# EasyEDA Pro project camara-detection.eprj, board XiaoZhi
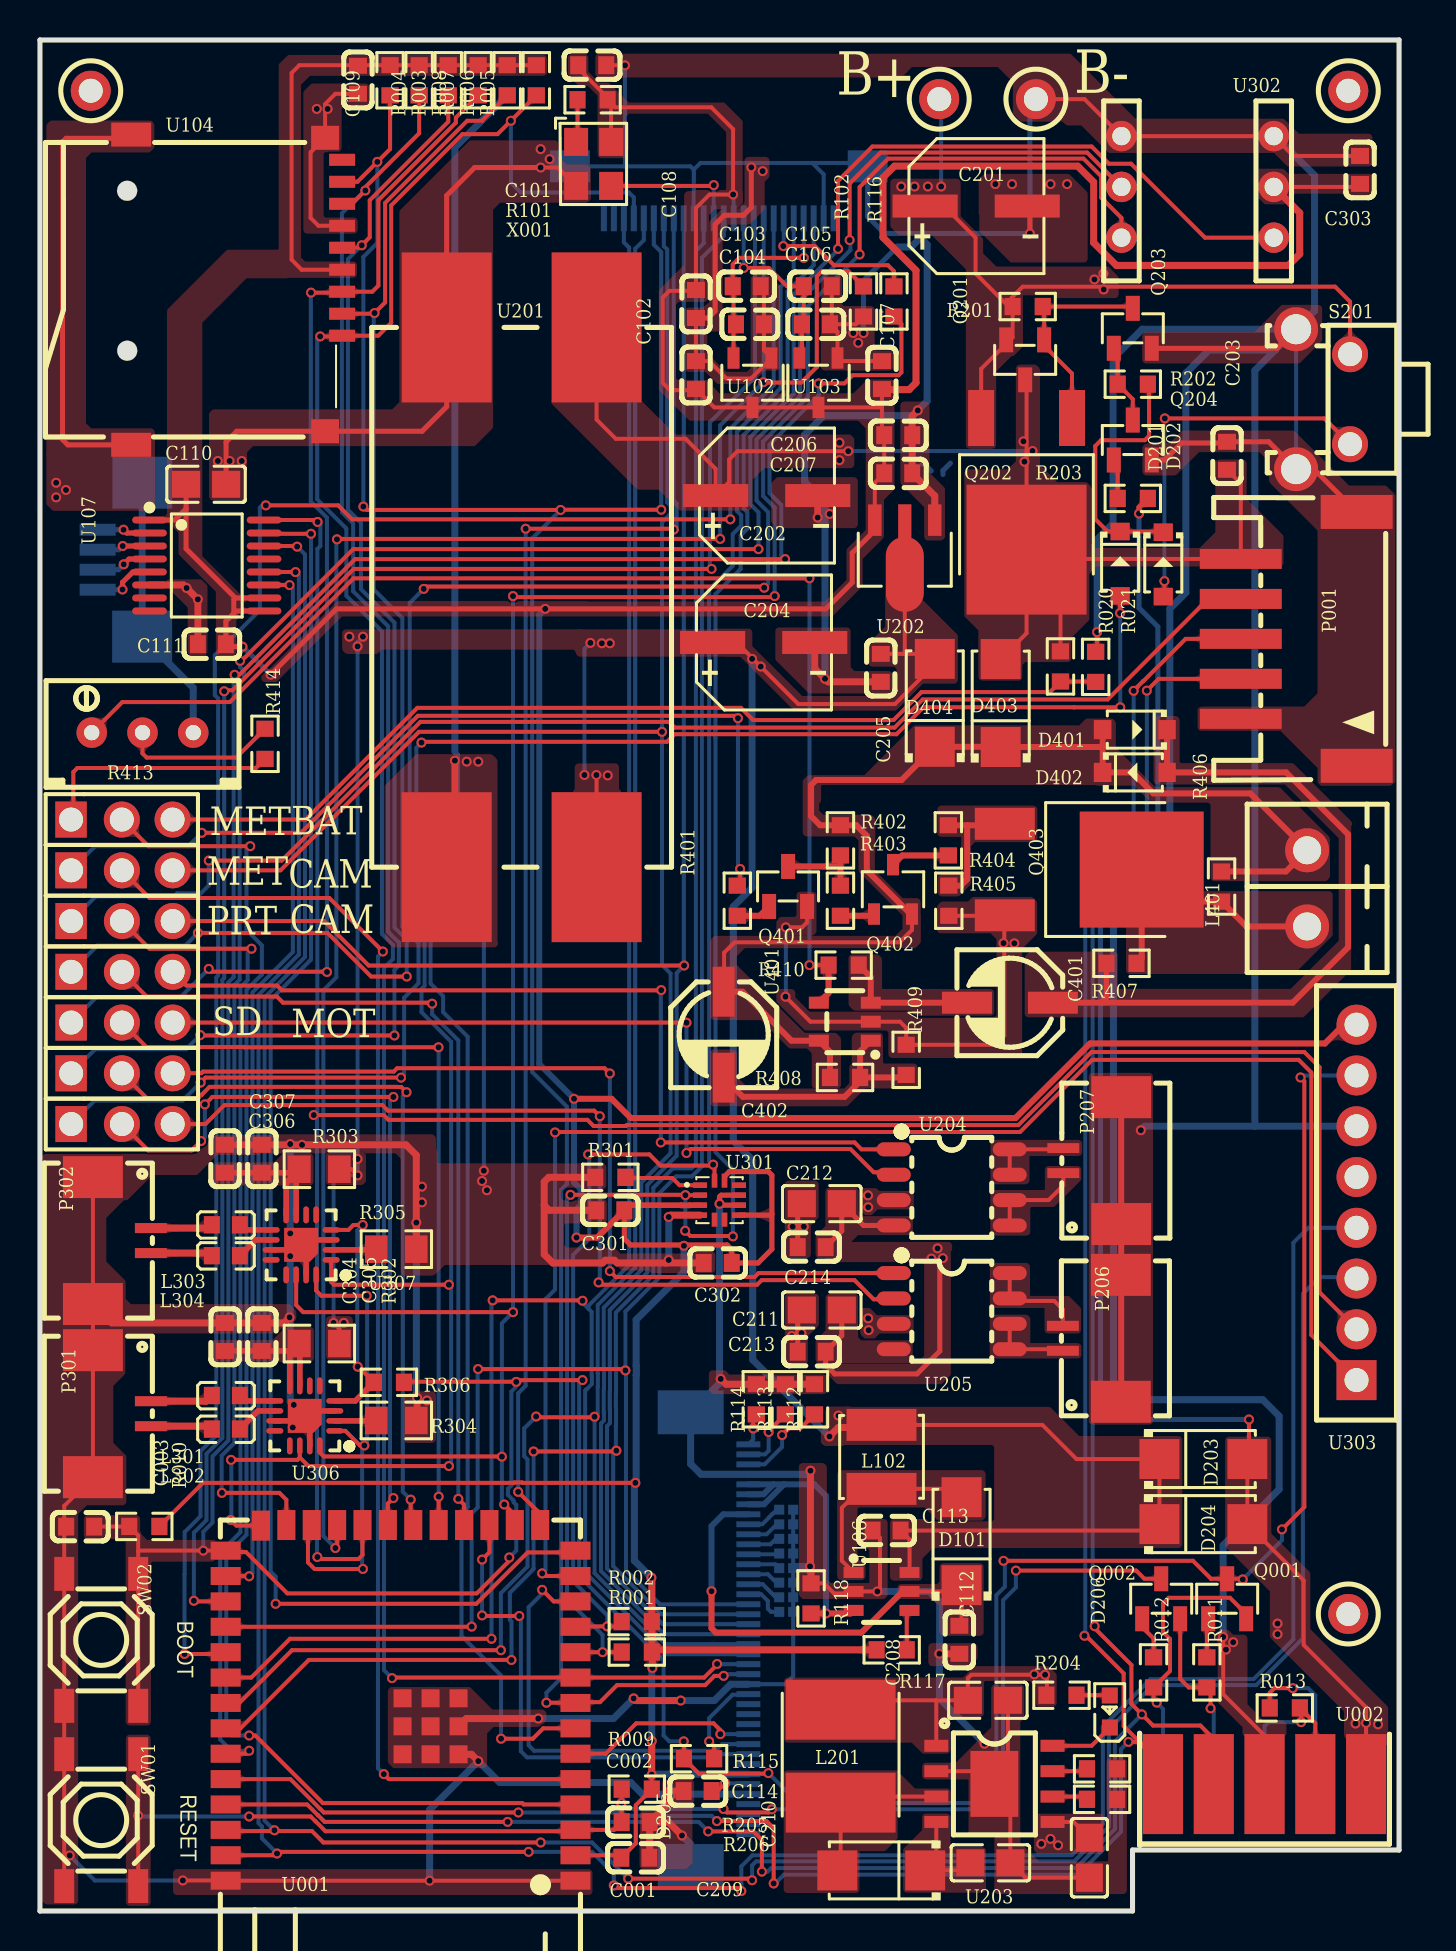
[diagram p3: board, top side]
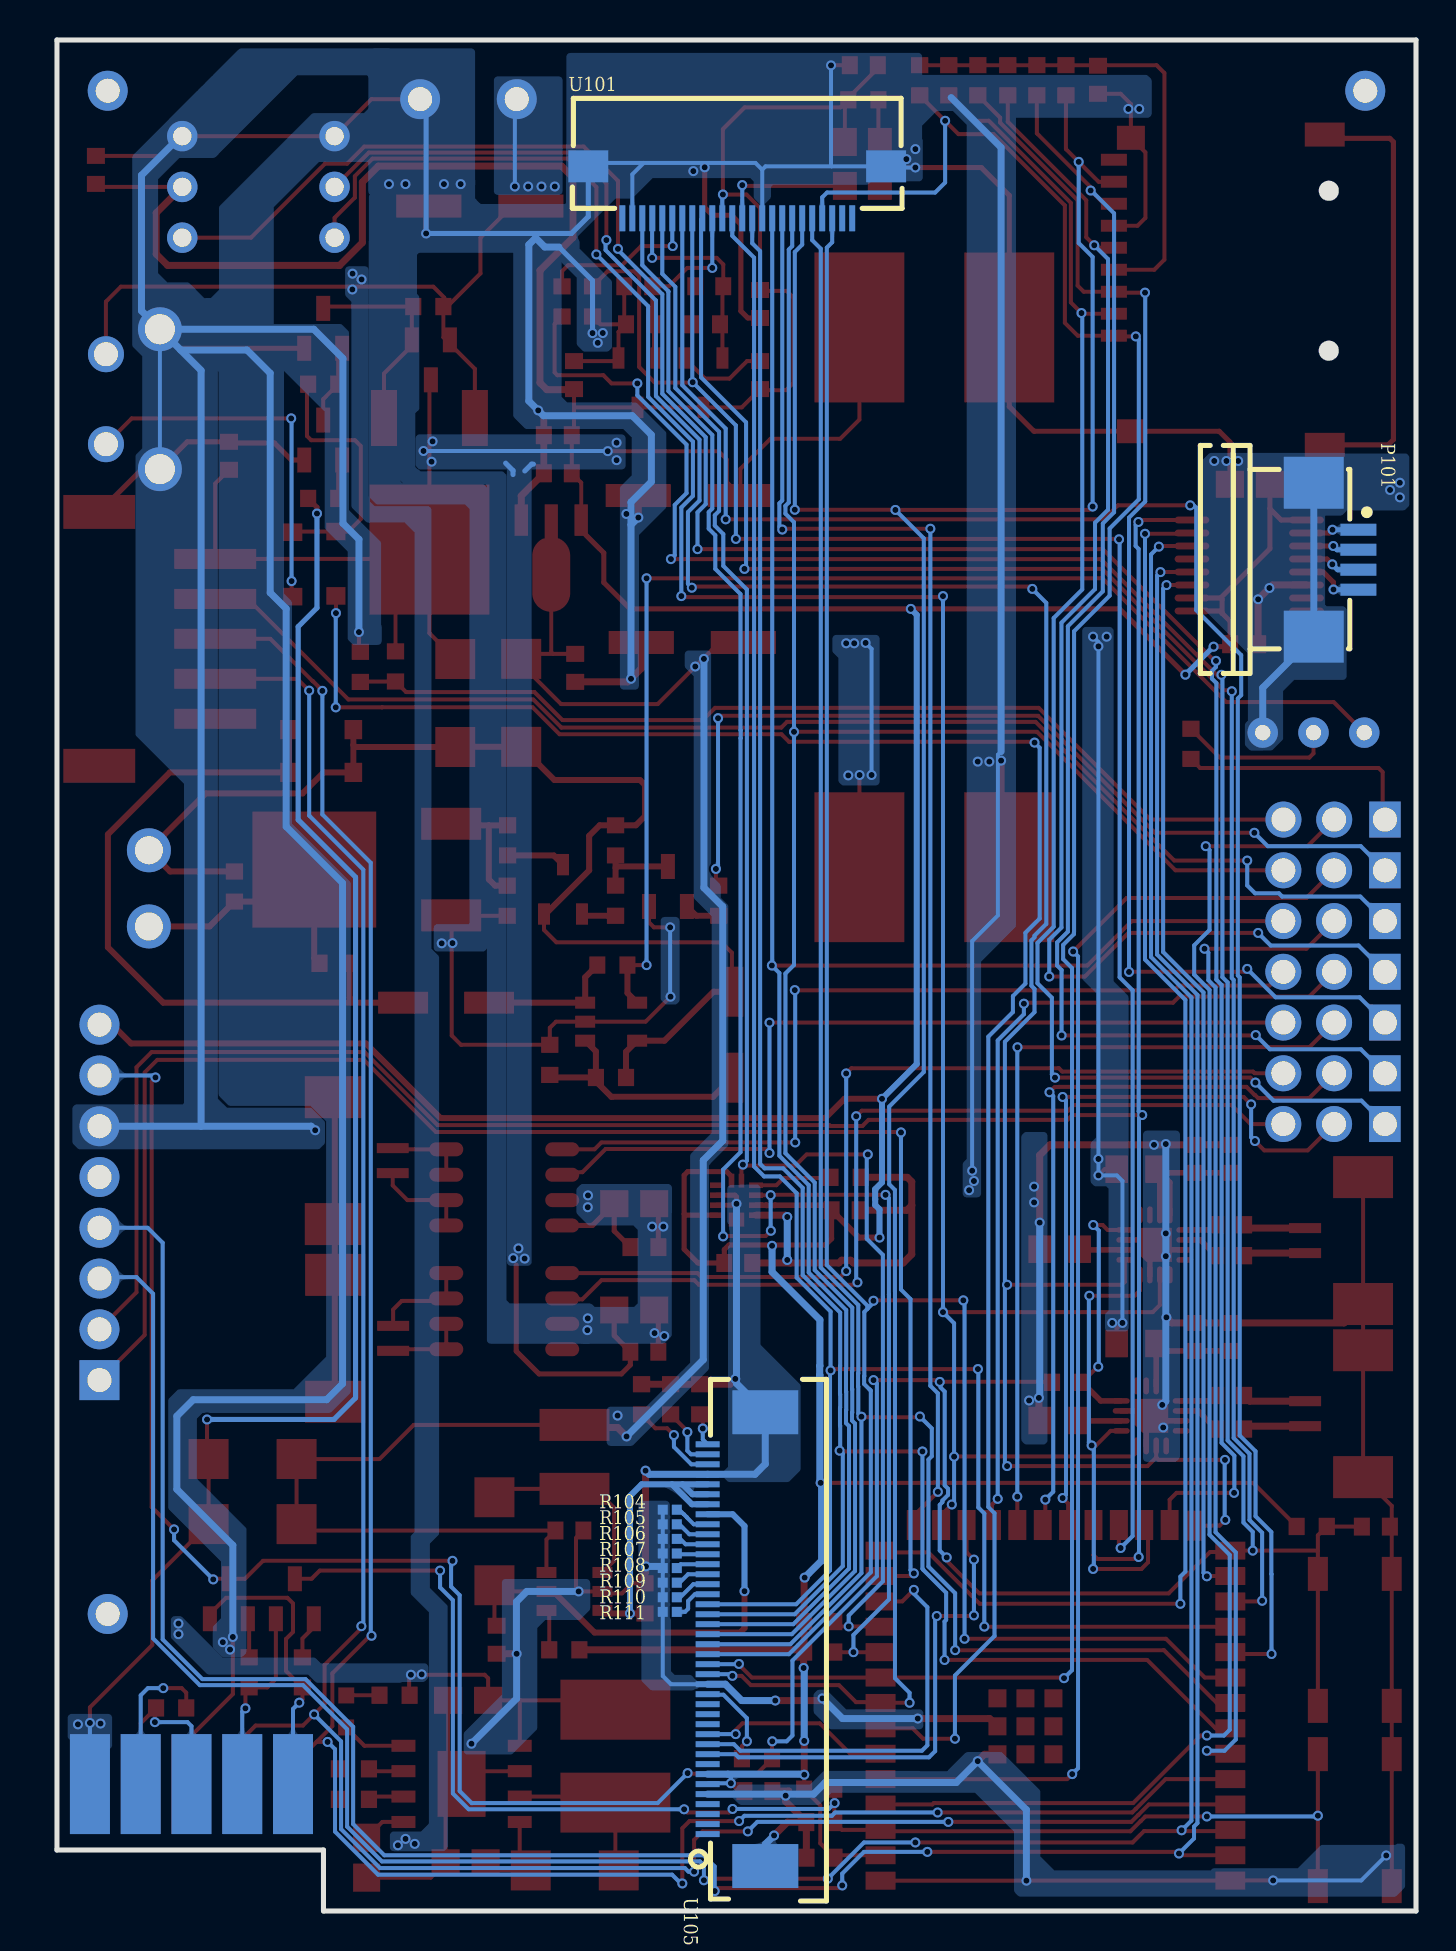
[diagram p4: board, bottom side, seen from below]

Outline 68 x 93.6 mm; copper layers: Top Layer, Bottom Layer. Coordinates in mm from the lower left corner of the outline.
Outline path: 0,93.6 68,93.6 68,3.05 54.67,3.05 54.67,0 0,0 0,93.6
Stack: SUBSTRATE1 0.32mm FR-4 er 4.8 / Bottom Layer 0.035mm

## Design rules (mm)
spacing copperThickness1oz (default): track to track 0.254, other pairs 0.254 to 0.3
spacing copperThickness2oz: track to track 0.254, other pairs 0.254 to 0.3
track width copperThickness1oz (default): min 0.127, default 0.127, max 2.54
track width copperThickness2oz: min 0.203, default 0.203, max 2.54
differential pair differentialPair (default): width min 0.127, default 0.127, max 2.54; gap min 0.152, default 0.152
via viaSize (default): diameter min 0.5, default 0.5, max 10; hole min 0.3, default 0.3, max 6.3

## Placement (name value [footprint] x y rotation side)
C001  CAP_0603  [C0603]  29.79 2.67 180 top
C002  CAP_0603  [C0603]  29.81 4.44 0 top
C003  CAP_0603  [C0603]  2.01 19.23 180 top
C101  CAP_0603  [C0603]  27.63 92.34 0 top
C102  CAP_0603  [C0603]  32.82 76.83 270 top
C103  CAP_0603  [C0603]  35.36 81.28 0 top
C104  CAP_0603  [C0603]  35.52 79.37 0 top
C105  CAP_0603  [C0603]  38.92 81.28 0 top
C106  CAP_0603  [C0603]  38.83 79.37 0 top
C107  100nF  [C0603]  42.13 76.83 90 top
C108  0.1UF  [C0603]  32.82 80.39 270 top
C109  CAP_0603  [C0603]  15.91 91.61 90 top
C110  CGA0805X5R106K250MT  [C0805]  8.31 71.37 0 top
C111  CGA0603X7R104K500JT  [C0603]  8.6 63.37 0 top
C112  1uF  [C0603]  46 13.57 90 top
C113  1uF  [C0603]  42.36 19.03 0 top
C114  CAP_0603  [C0603]  32.9 6 180 top
C201  VEJ101M1CTR-0605  [CAP-SMD_BD6.3-L6.6-W6.6-LS7.2-R-RD]  46.84 85.29 180 top
C202  VEJ101M1CTR-0605  [CAP-SMD_BD6.3-L6.6-W6.6-LS7.2-R-RD]  36.36 70.81 180 top
C203  CAP_0603  [C0603]  59.39 72.8 270 top
C204  VEJ101M1CTR-0605  [CAP-SMD_BD6.3-L6.6-W6.6-LS7.2-R-RD]  36.21 63.46 180 top
C205  CAP_0603  [C0603]  42.07 62.19 90 top
C206  CAP_0603  [C0603]  42.94 73.83 180 top
C207  CAP_0603  [C0603]  42.94 71.92 180 top
C208  CAP_0603  [C0805]  47.43 10.54 0 top
C209  CAP_0603  [C0805]  47.55 2.41 0 top
C210  CAP_0603  [C0805]  52.51 2.67 270 top
C211  CAP_0603  [C0805]  39.12 30.07 180 top
C212  CAP_0603  [C0805]  39.12 35.39 180 top
C213  CAP_0603  [C0603]  38.61 27.98 0 top
C214  CAP_0603  [C0603]  38.61 33.21 0 top
C301  CGA0603X7R104K500JT  [C0603]  28.54 35.05 180 top
C302  CGA0603X7R104K500JT  [C0603]  33.91 32.42 0 top
C303  CGA0603X7R104K500JT  [C0603]  66.05 87.1 270 top
C304  22uF  [C0603]  9.26 28.72 270 top
C305  100nF  [C0603]  11.1 28.72 270 top
C306  22uF  [C0603]  11.1 37.63 270 top
C307  100nF  [C0603]  9.26 37.63 270 top
C401  1uF/50V  [CAP-SMD_BD5.0-L5.3-W5.3-RD]  48.53 45.44 0 top
C402  100uF/50V  [CAP-SMD_BD5.0-L5.3-W5.3-RD]  34.21 43.84 90 top
D101  SS14_C84343  [SMA_L4.3-W2.6-LS5.2-RD]  46.11 18.5 90 top
D201  1N4148W-E3-18  [SOD-123_L2.7-W1.6-LS3.7-FD]  56.2 67.36 90 top
D202  1N4148W-E3-18  [SOD-123_L2.7-W1.6-LS3.7-FD]  54.04 67.4 90 top
D203  SS34A_C211775  [SMA_L4.3-W2.6-LS5.2-RD]  58.21 22.61 0 top
D204  SS34A_C211775  [SMA_L4.3-W2.6-LS5.2-RD]  58.21 19.35 0 top
D205  SS34A_C211775  [SMA_L4.3-W2.6-LS5.2-RD]  42.09 2.03 180 top
D206  LED_0603-R  [LED_0603]  53.52 10.03 90 top
D401  1N4148W-E3-18  [SOD-123_L2.7-W1.6-LS3.7-FD]  54.78 59.1 0 top
D402  1N4148W-E3-18  [SOD-123_L2.7-W1.6-LS3.7-FD]  54.78 56.96 180 top
D403  SS34A_C211775  [SMA_L4.3-W2.6-LS5.2-RD]  48.07 60.43 90 top
D404  SS34A_C211775  [SMA_L4.3-W2.6-LS5.2-RD]  44.77 60.44 90 top
H001  2.54-1*3P针  [HDR-TH_3P-P2.54-V-M-1]  4.09 54.6 0 top
H002  2.54-1*3P针  [HDR-TH_3P-P2.54-V-M-1]  4.1 52.06 0 top
H003  2.54-1*3P针  [HDR-TH_3P-P2.54-V-M-1]  4.1 49.52 0 top
H004  2.54-1*3P针  [HDR-TH_3P-P2.54-V-M-1]  4.1 46.98 0 top
H005  2.54-1*3P针  [HDR-TH_3P-P2.54-V-M-1]  4.1 44.45 0 top
H006  2.54-1*3P针  [HDR-TH_3P-P2.54-V-M-1]  4.1 41.91 0 top
H007  2.54-1*3P针  [HDR-TH_3P-P2.54-V-M-1]  4.1 39.37 0 top
L102  YNR4030-220M  [IND-SMD_L4.0-W4.0]  42.11 22.72 270 top
L201  2.2uH  [IND-SMD_L5.8-W5.2]  40.06 7.75 270 top
L301  1uH  [L0603]  9.3 25.79 180 top
L302  1uH  [L0603]  9.3 24.11 180 top
L303  1uH  [L0603]  9.3 34.33 180 top
L304  1uH  [L0603]  9.3 32.78 180 top
L401  300~500uH  [CONN-TH_2P-P3.81_KF2EDGV-3.81-2P]  63.4 51.16 90 top
P001  HX20007-5AWB  [CONN-SMD_5P-P2.00_HX20007-5AWB]  62.98 63.64 90 top
P101  TS  [FPC-SMD_4P-P1.00_AFA07-S04ECA-00]  4 67.6 270 bottom
P201  -  [Single_Pin]  65.46 14.86 0 top
P202  -  [Single_Pin]  49.83 90.64 0 top
P203  -  [Single_Pin]  2.54 91.06 0 top
P204  -  [Single_Pin]  65.46 91.06 0 top
P205  -  [Single_Pin]  44.99 90.64 0 top
P206  1.25-2P WT  [CONN-SMD_1.25-2PWT]  52.63 28.65 270 top
P207  1.25-2P WT  [CONN-SMD_1.25-2PWT]  52.65 37.54 270 top
P301  1.25-2P WT  [CONN-SMD_1.25-2PWT]  4.1 24.88 90 top
P302  1.25-2P WT  [CONN-SMD_1.25-2PWT]  4.1 33.54 90 top
Q001  SS8050  [SOT-23-3_L2.9-W1.3-P1.90-LS2.4-BR]  59.4 15.62 270 top
Q002  SS8050  [SOT-23-3_L2.9-W1.3-P1.90-LS2.4-BR]  56.1 15.62 270 top
Q201  AO3401_C181091  [SOT-23-3_L2.9-W1.3-P1.90-LS2.4-BR]  49.29 77.6 90 top
Q202  NCE40P40K  [TO-252-2_L6.6-W6.1-P4.57-LS9.9-TL-CW]  49.36 71.4 270 top
Q203  SS8050  [SOT-23-3_L2.9-W1.3-P1.90-LS2.4-BR]  54.68 79.17 270 top
Q204  SS8050  [SOT-23-3_L2.9-W1.3-P1.90-LS2.4-BR]  54.68 73.59 270 top
Q401  MMBT3904  [SOT-23-3_L2.9-W1.3-P1.90-LS2.4-BR]  37.43 51.25 270 top
Q402  MMBT3906-7-F  [SOT-23-3_L2.9-W1.6-P1.90-LS2.8-BR]  42.68 51.11 270 top
Q403  WSF10N40  [TO-252-2_L6.6-W6.1-P4.57-LS9.9-BR-CW]  51.7 52.1 180 top
R001  3.3K  [R0603]  29.86 12.95 180 top
R002  3.3K  [R0603]  29.86 14.48 180 top
R003  3.3K  [R0603]  18.97 91.58 270 top
R004  3.3K  [R0603]  17.52 91.58 270 top
R005  3.3K  [R0603]  24.83 91.58 270 top
R006  3.3K  [R0603]  23.38 91.58 270 top
R007  3.3K  [R0603]  21.92 91.58 270 top
R008  3.3K  [R0603]  20.43 91.58 270 top
R009  10K  [R0603]  29.86 6.1 0 top
R010  10K  [R0603]  5.22 19.24 0 top
R011  10K  [R0603]  58.38 11.94 270 top
R012  10K  [R0603]  55.72 11.94 270 top
R013  10  [R0603]  62.29 10.16 180 top
R020  100K  [R0603]  51.06 62.26 270 top
R021  10K  [R0603]  52.82 62.24 90 top
R101  4.7K  [R0603]  27.65 90.61 0 top
R102  4.7K  [R0603]  41.2 80.52 270 top
R104  0R  [short_package]  37.34 20.07 270 bottom
R105  0R  [short_package]  37.34 19.34 270 bottom
R106  0R  [short_package]  37.34 18.62 270 bottom
R107  0R  [short_package]  37.34 17.89 270 bottom
R108  0R  [short_package]  37.34 17.16 270 bottom
R109  0R  [short_package]  37.34 16.43 270 bottom
R110  0R  [short_package]  37.34 15.7 270 bottom
R111  0R  [short_package]  37.34 14.97 270 bottom
R112  0R  [R0603]  38.75 25.6 270 top
R113  0R  [R0603]  37.3 25.6 270 top
R114  0R  [R0603]  35.84 25.6 270 top
R115  0R  [R0603]  32.98 7.62 0 top
R116  0R  [R0603]  42.73 80.52 90 top
R117  1k  [R0603]  42.61 13.07 180 top
R118  5.1R  [R0603]  38.58 15.64 270 top
R201  Res_0603  [R0603]  49.42 80.26 180 top
R202  Res_0603  [R0603]  54.68 76.38 0 top
R203  Res_0603  [R0603]  54.68 70.67 0 top
R204  Res_0603  [R0603]  51.11 10.79 180 top
R205  Res_0603  [R0603]  53.14 7.11 180 top
R206  Res_0603  [R0603]  53.14 5.59 180 top
R301  2R2  [R0603]  28.54 36.7 0 top
R302  0805W8F1002T5E_C17414  [R0805]  13.98 28.39 180 top
R303  0805W8F1002T5E_C17414  [R0805]  13.98 37.11 180 top
R304  NC  [R0805]  17.83 24.54 180 top
R305  NC  [R0805]  17.83 33.11 180 top
R306  CR0603FA10R0G  [R0603]  17.46 26.45 180 top
R401  1K  [R0603]  34.89 50.54 270 top
R402  6.8K  [R0603]  40.05 53.56 90 top
R403  1K  [R0603]  40.05 50.54 270 top
R404  100  [R0603]  45.45 53.56 270 top
R405  150  [R0603]  45.47 50.54 90 top
R406  390  [R0603]  59.12 51.25 90 top
R407  390  [R0603]  54.11 47.41 0 top
R408  47K  [R0603]  40.28 41.7 0 top
R409  62K  [R0603]  43.34 42.58 90 top
R410  2M  [R0603]  40.21 47.32 0 top
R413  3296W-1-102_C330429  [RES-ADJ-TH_3296W]  5.13 58.95 90 top
R414  10  [R0603]  11.26 58.39 270 top
S201  TC-1102N-C-A-B  [SW-TH_TC-1102N-C-A-B]  64.2 75.63 90 top
SW01  TS-1187A-B-A-B  [SW-SMD_4P-L5.1-W5.1-P3.70-LS6.5-TL-2]  3.06 4.55 270 top
SW02  TS-1187A-B-A-B  [SW-SMD_4P-L5.1-W5.1-P3.70-LS6.5-TL-2]  3.06 13.56 270 top
U001  -  [ESP32-S3-WROOM-1U]  17.92 10.41 180 top
U002  CH343_Module  [CH343_Module_Mini]  61.4 6.35 180 top
U101  ov2640  [FPC-SMD_P0.50-24P_FGS-XJ-H2.0]  33.96 85.98 180 bottom
U102  XC6206-2.8V  [SOT-23-3_L2.9-W1.6-P1.90-LS2.8-BR]  35.65 76.45 90 top
U103  XC6206-2.8V  [SOT-23-3_L2.9-W1.6-P1.90-LS2.8-BR]  38.95 76.45 90 top
U104  TF-01A_C91145  [TF-SMD_TF-01A]  9.84 81.11 270 top
U105  NV3041_480X272  [FPC-SMD_AFC07-S40FCA-00]  34 13.6 90 bottom
U106  MT9201  [SOT-23-6_L2.9-W1.6-P0.95-LS2.8-BR]  42.11 15.99 180 top
U107  TSC2046IPWR  [TSSOP-16_L5.0-W4.4-P0.65-LS6.4-BL]  8.35 67.31 270 top
U201  CX8823_5V  [CX8823_MO]  31.6 79.22 270 top
U202  ME6209A33PG  [SOT-89-3_L4.5-W2.5-P1.50-LS4.2-BR]  43.27 68.22 90 top
U203  CS5095E  [ESOP-8_L4.9-W3.9-P1.27-LS6.0-BL-EP]  47.75 6.36 270 top
U204  AM2837  [sop-8_l5.0-w4.0-p1.27-ls6.2-bl]  45.62 36.2 270 top
U205  AM2837  [sop-8_l5.0-w4.0-p1.27-ls6.2-bl]  45.62 30.01 270 top
U301  SC7A20HTR  [LGA-12_L2.0-W2.0-P0.50-TL]  34 35.56 0 top
U302  INMP441  [INMP441_MODULE]  61.73 83.71 90 top
U303  -  [RFID_RC522]  67.87 16.56 90 top
U306  HT517  [QFN-16_L3.0-W3.0-P0.50-TL-EP1.7]  13.25 24.77 180 top
U307  HT517  [QFN-16_L3.0-W3.0-P0.50-TL-EP1.7]  13.07 33.32 180 top
U401  LM321-TR_C97688  [SOT-23-5_L3.0-W1.7-P0.95-LS2.8-BR]  40.27 44.49 0 top
X001  Q33310F70049000  [OSC-SMD_4P-L3.2-W2.5-BL]  27.7 87.4 270 top

## Footprints (pads in the part's own frame, mm; a bottom-side part is the same pattern mirrored in y, then rotated)
C0603
  rect 0.8x0.9 smd: 1(-0.7,0) 2(0.7,0)
C0805
  rect 1.41x1.35 smd: 1(-1,0) 2(1,0)
CAP-SMD_BD5.0-L5.3-W5.3-RD
  rect 2.5x1.1 smd: 1(2.15,0) 2(-2.15,0)
CAP-SMD_BD6.3-L6.6-W6.6-LS7.2-R-RD
  rect 3.26x1.15 smd: 1(2.555,0) 2(-2.555,0)
CH343_Module_Mini
  rect 2x5 smd: 1(-4.953,0) 2(-2.413,0) 3(0.127,0) 4(2.667,0) 5(5.207,0)
  rect 2x5 smd far side: 6(5.207,0) 7(2.667,0) 8(0.127,0) 9(-2.413,0) 10(-4.953,0)
CONN-SMD_1.25-2PWT
  rect 0.5x1.6 smd: 1(0.625,-1.45) 2(-0.625,-1.45)
  rect 2.1x2.999 smd: 3(3.175,1.45) 4(-3.175,1.45)
CONN-SMD_5P-P2.00_HX20007-5AWB
  rect 1.001x4.099 smd: 1(-4,2.901) 2(-1.999,2.901) 3(0,2.901) 4(1.999,2.901) 5(4,2.901)
  rect 1.7x3.599 smd: 6(6.35,-2.901) 7(-6.35,-2.901)
CONN-TH_2P-P3.81_KF2EDGV-3.81-2P
  round 2.2 hole 1.4: 1(-1.905,0) 2(1.905,0)
CX8823_MO
  rect 7.5x4.5 smd: 1(0,-3.75) 2(27,-3.75) 3(0,-11.25) 4(27,-11.25)
ESOP-8_L4.9-W3.9-P1.27-LS6.0-BL-EP
  rect 0.6x1.2 smd: 1(-1.905,-2.909) 2(-0.635,-2.909) 3(0.635,-2.909) 4(1.905,-2.909) 5(1.905,2.909) 6(0.635,2.909) 7(-0.635,2.909) 8(-1.905,2.909)
  rect 3.3x2.4 smd: 9(0,0)
ESP32-S3-WROOM-1U
  rect 1.5x0.9 smd: 1(-8.877,8.895) 2(-8.877,7.625) 3(-8.877,6.355) 4(-8.877,5.085) 5(-8.877,3.815) 6(-8.877,2.545) 7(-8.877,1.275) 8(-8.877,0.005) 9(-8.877,-1.265) 10(-8.877,-2.535) 11(-8.877,-3.805) 12(-8.877,-5.075) 13(-8.877,-6.345) 14(-8.877,-7.615) 27(8.623,-7.615) 28(8.623,-6.345) 29(8.623,-5.075) 30(8.623,-3.805) 31(8.623,-2.535) 32(8.623,-1.265) 33(8.623,0.005) 34(8.623,1.275) 35(8.623,2.545) 36(8.623,3.815) 37(8.623,5.085) 38(8.623,6.355) 39(8.623,7.625) 40(8.623,8.895)
  rect 0.9x1.5 smd: 15(-7.112,-8.895) 16(-5.842,-8.895) 17(-4.572,-8.895) 18(-3.302,-8.895) 19(-2.032,-8.895) 20(-0.762,-8.895) 21(0.508,-8.895) 22(1.778,-8.895) 23(3.048,-8.895) 24(4.318,-8.895) 25(5.588,-8.895) 26(6.858,-8.865)
  rect 0.9x0.9 smd: 41(-3.027,2.575) 41(-3.027,1.175) 41(-3.027,-0.225) 41(-1.627,2.575) 41(-1.627,1.175) 41(-1.627,-0.225) 41(-0.227,2.575) 41(-0.227,1.175) 41(-0.227,-0.225)
FPC-SMD_4P-P1.00_AFA07-S04ECA-00
  rect 0.6x1.8 smd: 1(-1.5,1.115) 2(-0.5,1.115) 3(0.5,1.115) 4(1.5,1.115)
  rect 2.6x3 smd: 5(3.85,-1.115) 6(-3.85,-1.115)
FPC-SMD_AFC07-S40FCA-00
  rect 0.299x1.199 smd: 1(-9.751,1.442) 2(-9.251,1.442) 3(-8.753,1.442) 4(-8.252,1.442) 5(-7.752,1.442) 6(-7.252,1.442) 7(-6.752,1.442) 8(-6.251,1.442) 9(-5.753,1.442) 10(-5.253,1.442) 11(-4.753,1.442) 12(-4.252,1.442) 13(-3.752,1.442) 14(-3.251,1.442) 15(-2.751,1.442) 16(-2.253,1.442) 17(-1.752,1.442) 18(-1.252,1.442) 19(-0.752,1.442) 20(-0.252,1.442) 21(0.249,1.442) 22(0.75,1.442) 23(1.247,1.442) 24(1.748,1.442) 25(2.248,1.442) 26(2.748,1.442) 27(3.248,1.442) 28(3.749,1.442) 29(4.247,1.442) 30(4.747,1.442) 31(5.247,1.442) 32(5.748,1.442) 33(6.248,1.442) 34(6.749,1.442) 35(7.249,1.442) 36(7.747,1.442) 37(8.248,1.442) 38(8.748,1.442) 39(9.248,1.442) 40(9.748,1.442)
  rect 2.2x3.3 smd: 41(-11.348,-1.442) 42(11.351,-1.442)
FPC-SMD_P0.50-24P_FGS-XJ-H2.0
  rect 0.3x1.3 smd: 1(-5.748,-1.3) 2(-5.248,-1.3) 3(-4.748,-1.3) 4(-4.248,-1.3) 5(-3.748,-1.3) 6(-3.248,-1.3) 7(-2.748,-1.3) 8(-2.248,-1.3) 9(-1.748,-1.3) 10(-1.248,-1.3) 11(-0.748,-1.3) 12(-0.248,-1.3) 13(0.252,-1.3) 14(0.752,-1.3) 15(1.252,-1.3) 16(1.752,-1.3) 17(2.252,-1.3) 18(2.752,-1.3) 19(3.252,-1.3) 20(3.752,-1.3) 21(4.252,-1.3) 22(4.752,-1.3) 23(5.252,-1.3) 24(5.752,-1.3)
  rect 2x1.6 smd: 25(7.45,1.3) 26(-7.45,1.3)
HDR-TH_3P-P2.54-V-M-1
  rect 1.575x1.801 hole 1.199: 1(-2.54,0)
  round 1.801 hole 1.199: 2(0,0) 3(2.54,0)
IND-SMD_L4.0-W4.0
  rect 1.6x3.5 smd: 1(-1.6,0) 2(1.6,0)
IND-SMD_L5.8-W5.2
  rect 3x5.5 smd: 1(2.325,0) 2(-2.325,0)
INMP441_MODULE
  round 1.524 hole 0.914: 1(0,0) 2(2.54,0) 3(5.08,0) 4(5.08,7.62) 5(2.54,7.62) 6(0,7.62)
L0603
  rect 0.8x0.864 smd: 1(-0.7,0) 2(0.7,0)
LED_0603
  rect 0.8x0.8 smd: 1(-0.851,-0.01) 2(0.75,-0.005)
LGA-12_L2.0-W2.0-P0.50-TL
  rect 0.7x0.28 smd: 1(-0.975,0.75) 2(-0.975,0.25) 3(-0.975,-0.25) 4(-0.975,-0.75) 7(0.975,-0.75) 8(0.975,-0.25) 9(0.975,0.25) 10(0.975,0.75)
  rect 0.28x0.7 smd: 5(-0.25,-0.975) 6(0.25,-0.975) 11(0.25,0.975) 12(-0.25,0.975)
OSC-SMD_4P-L3.2-W2.5-BL
  rect 1.4x1.2 smd: 1(-1.1,-0.875) 2(1.1,-0.875) 3(1.1,0.875) 4(-1.1,0.875)
QFN-16_L3.0-W3.0-P0.50-TL-EP1.7
  oval 0.851x0.28 smd: 1(-1.501,0.75) 2(-1.501,0.249) 3(-1.501,-0.249) 4(-1.501,-0.75) 9(1.501,-0.75) 10(1.501,-0.249) 11(1.501,0.249) 12(1.501,0.75)
  oval 0.28x0.851 smd: 5(-0.75,-1.501) 6(-0.249,-1.501) 7(0.249,-1.501) 8(0.75,-1.501) 13(0.75,1.501) 14(0.249,1.501) 15(-0.249,1.501) 16(-0.75,1.501)
  round 0.341 smd: 17(0,0)
R0603
  rect 0.806x0.864 smd: 1(-0.753,0) 2(0.753,0)
R0805
  rect 1.133x1.377 smd: 1(-1,0) 2(1,0)
RES-ADJ-TH_3296W
  round 1.524 hole 0.762: 1(0,2.54) 2(0,0) 3(0,-2.54)
RFID_RC522
  rect 2x2 hole 1.2: 1(10,2)
  round 2 hole 1.2: 2(12.54,2) 3(15.08,2) 4(17.62,2) 5(20.16,2) 6(22.7,2) 7(25.24,2) 8(27.78,2)
short_package
  rect 0.5x0.5 smd: 1(0,0.35) 2(0,-0.35)
Single_Pin
  round 2 hole 1.2: 1(0,0)
SMA_L4.3-W2.6-LS5.2-RD
  rect 2x2 smd: 1(-2.2,0) 2(2.2,0)
SOD-123_L2.7-W1.6-LS3.7-FD
  rect 0.879x0.96 smd: 1(-1.611,0) 2(1.611,0)
sop-8_l5.0-w4.0-p1.27-ls6.2-bl
  oval 0.701x1.7 smd: 1(-1.905,-2.901) 2(-0.635,-2.901) 3(0.635,-2.901) 4(1.905,-2.901) 5(1.905,2.901) 6(0.635,2.901) 7(-0.635,2.901) 8(-1.905,2.901)
SOT-23-3_L2.9-W1.3-P1.90-LS2.4-BR
  rect 1.25x0.7 smd: 1(1,-0.95) 2(1,0.95) 3(-1,0)
SOT-23-3_L2.9-W1.6-P1.90-LS2.8-BR
  rect 1.07x0.6 smd: 1(1.235,-0.95) 2(1.235,0.95) 3(-1.235,0)
SOT-23-5_L3.0-W1.7-P0.95-LS2.8-BR
  rect 1x0.6 smd: 1(1.3,-0.95) 2(1.3,0) 3(1.3,0.95) 4(-1.3,0.95) 5(-1.3,-0.95)
SOT-23-6_L2.9-W1.6-P0.95-LS2.8-BR
  rect 1x0.55 smd: 1(1.4,-0.95) 2(1.4,0) 3(1.4,0.95) 4(-1.4,0.95) 5(-1.4,0) 6(-1.4,-0.95)
SOT-89-3_L4.5-W2.5-P1.50-LS4.2-BR
  rect 1.575x0.672 smd: 1(1.356,-1.5) 3(1.356,1.5)
  round 0.38 smd: 2(-1.356,0)
SW-SMD_4P-L5.1-W5.1-P3.70-LS6.5-TL-2
  rect 1.7x1 smd: 1(-3.3,1.85) 2(3.3,1.85) 3(-3.3,-1.85) 4(3.3,-1.85)
SW-TH_TC-1102N-C-A-B
  round 1.801 hole 1.199: 1(-2.251,-1.349) 2(2.251,-1.349)
  round 2.2 hole 1.501: 3(-3.5,1.351) 4(3.5,1.351)
TF-SMD_TF-01A
  rect 0.6x1.3 smd: 1(2.3,5.276) 2(1.2,5.276) 3(0.101,5.276) 4(-1,5.276) 5(-2.099,5.276) 6(-3.2,5.276) 7(-4.3,5.276) 8(-5.399,5.276) 9(-6.5,5.276)
  rect 1.2x1.4 smd: 10(-7.599,4.426) 13(7.08,4.426)
  rect 1.2x2 smd: 11(-7.76,-5.276) 12(7.76,-5.276)
TO-252-2_L6.6-W6.1-P4.57-LS9.9-BR-CW
  rect 3x1.6 smd: 1(3.424,-2.29) 3(3.424,2.29)
  rect 6.2x5.8 smd: 2(-3.424,0)
TO-252-2_L6.6-W6.1-P4.57-LS9.9-TL-CW
  rect 2.8x1.3 smd: 1(-3.292,2.273) 3(-3.292,-2.273)
  rect 6.5x6 smd: 2(3.292,0)
TSSOP-16_L5.0-W4.4-P0.65-LS6.4-BL
  oval 0.343x1.732 smd: 1(-2.275,-2.866) 2(-1.625,-2.866) 3(-0.975,-2.866) 4(-0.325,-2.866) 5(0.325,-2.866) 6(0.975,-2.866) 7(1.625,-2.866) 8(2.275,-2.866) 9(2.275,2.866) 10(1.625,2.866) 11(0.975,2.866) 12(0.325,2.866) 13(-0.325,2.866) 14(-0.975,2.866) 15(-1.625,2.866) 16(-2.275,2.866)

## Nets
+3V3: C001.2 C101.1 C102.2 C107.1 C108.1 C109.2 C110.1 C111.2 C114.1 C206.2 C207.2 C301.1 C302.2 C303.2 R001.1 R002.1 R003.1 R004.1 R005.1 R006.1 R007.1 R008.1 R009.2 R010.2 R101.2 R117.2 U001.2 U101.11 U102.3 U103.3 U104.4 U105.6 U105.7 U107.1 U107.9 U107.10 U202.3 U301.3 U301.7 U301.11 U302.2 U303.8 X001.4
+5V: C113.2 C204.1 C205.2 D203.1 D204.1 D404.2 L102.1 R302.1 R303.1 U106.6 U201.2 U202.2
+12V: C202.1 C203.2 C211.1 C212.1 C213.2 C214.2 D403.2 P001.5 Q201.3 Q202.2 R020.1 U201.1 U204.4 U205.4
GND: C001.1 C002.2 C003.2 C101.2 C102.1 C103.2 C104.2 C105.2 C106.2 C107.2 C108.2 C109.1 C110.2 C111.1 C112.1 C113.1 C114.2 C201.2 C202.2 C203.1 C204.2 C205.1 C206.1 C207.1 C208.2 C209.2 C210.2 C211.2 C212.2 C213.1 C214.1 C301.2 C302.1 C303.1 C304.1 C305.1 C306.1 C307.1 P001.1 P001.6 P001.7 P101.5 P101.6 P202.1 P206.3 P206.4 P207.3 P207.4 P301.3 P301.4 P302.3 P302.4 Q203.2 Q204.2 Q401.2 Q403.3 R021.2 R102.2 R104.2 R105.2 R106.2 R107.2 R108.2 R109.2 R110.2 R111.2 R112.1 R113.1 R114.1 R118.1 R205.1 R206.1 R301.1 R304.1 R305.1 R405.1 R409.2 R413.3 S201.3 S201.4 SW01.3 SW01.4 SW02.3 SW02.4 U001.1 U001.40 U001.41 U002.3 U101.2 U101.15 U101.25 U101.26 U102.1 U103.1 U104.6 U104.10 U104.11 U104.12 U104.13 U105.5 U105.16 U105.37 U105.41 U105.42 U106.2 U107.6 U201.3 U201.4 U202.1 U203.2 U203.9 U204.3 U205.3 U301.4 U301.8 U301.9 U302.3 U302.4 U303.6 U306.3 U306.11 U306.15 U306.17 U307.3 U307.11 U307.15 U307.17 U401.2 X001.2
CAM_1V2: C105.1 C106.1 U101.10 U103.2
CAM_2V8: C103.1 C104.1 U101.4 U102.2
CAM_D0: R004.2 U001.8 U101.19 U104.8 U105.17
CAM_D1: R005.2 U001.9 U101.21 U104.1 U105.18
CAM_D2: U001.32 U101.22 U105.19
CAM_D3: U001.33 U101.20 U105.20
CAM_D4: H002.3 U101.18 U105.21
CAM_D5: H003.3 U101.16 U105.22
CAM_D6: U001.34 U101.14 U105.23
CAM_D7: U001.30 U101.12 U105.24
CAM_HREF: U001.29 U101.9
CAM_PCLK: U001.15 U101.17
CAM_PWDN: R102.1 U001.23 U101.8
CAM_RESET: C003.1 Q001.3 R010.1 R115.1 R116.1 R306.1 SW02.1 SW02.2 U001.27 U303.7
CAM_SCL: R002.2 U001.11 U101.5 U301.12
CAM_SDA: R001.2 U001.10 U101.3 U301.2
CAM_VSYNC: U001.31 U101.7
CAM_XCLK: U101.13 X001.3
CH343_3V3: R013.1 U002.2 U002.8
ESP32_RXD: P001.3 U001.36 U002.5
ESP32_TXD: P001.2 U001.37 U002.4
GPIO1: U001.39 U107.12 U303.4
GPIO2: U001.38 U107.14 U303.3
GPIO4: H001.2 U001.4
GPIO5: H002.2 U001.5
GPIO6: U001.6 U105.11
GPIO7: D202.1 U001.7
GPIO8: U001.12 U105.10
GPIO9: U001.17 U105.9
GPIO10: H004.2 U001.18
GPIO11: H005.2 U001.19
GPIO12: H006.2 U001.20
GPIO13: H007.2 U001.21
GPIO14: U001.22 U107.16 U303.2
GPIO19: U001.13 U303.1
GPIO20: U001.14 U107.15
GPIO35: U001.28 U107.11
GPIO42: H003.2 U001.35
GPIO45: U001.26 U302.5 U306.14 U307.1
GPIO46: U001.16 U302.6 U306.16 U307.14
GPIO47: U001.24 U306.1 U307.16
GPIO48: U001.25 U302.1
METAL_ADC: H001.1 R414.2
METAL_DEC: H002.1 R401.1
MOT1_A: H004.3 U204.1
MOT1_B: H005.3 U204.2
MOT2_A: H006.3 U205.1
MOT2_B: H007.3 U205.2
PRINTER_DTR: H003.1 P001.4
SD_CLK/SCK: H004.1 R008.2 U104.5
SD_CMD/MOSI: H005.1 R007.2 U104.3
SD_D0/MISO: H006.1 R003.2 U104.7
SD_D3/CS: H007.1 R006.2 U104.2
SYS_RESET: C002.1 Q002.3 R009.1 SW01.1 SW01.2 U001.3
VBIN: C201.1 C210.1 P205.1 Q201.2 Q202.3 R201.2 S201.2 U203.5
VUSB: C208.1 D203.2 D204.2 L201.2 R203.2 R204.2 U002.1 U002.10 U203.1
$1N6454: Q002.2 R011.2 U002.7
$1N6461: Q001.2 R012.2 U002.6
$1N6467: Q001.1 R011.1
$1N6473: Q002.1 R012.1
$1N6533: R013.2 U002.9
$1N10662: H001.3 R020.2 R021.1
$2N1529: R101.1 X001.1
$2N3573: R104.1 U105.32
$2N3651: R105.1 U105.31
$2N3677: R106.1 U105.30
$2N3703: R107.1 U105.29
$2N3729: R108.1 U105.28
$2N3755: R109.1 U105.27
$2N3781: R110.1 U105.26
$2N3807: R111.1 U105.25
$2N3906: R112.2 U105.38
$2N3932: R113.2 U105.39
$2N3958: R114.2 U105.40
$2N4007: R115.2 U105.15
$2N4034: R116.2 U101.6
$2N4288: P101.1 U107.2
$2N4289: P101.2 U107.3
$2N4290: P101.3 U107.4
$2N4291: P101.4 U107.5
$2N5674: C112.2 D101.1 U105.33 U106.5
$2N5846: R118.2 U105.34 U105.35 U105.36 U106.3
$2N9566: D101.2 L102.2 U106.1
$2N9598: R117.1 U106.4
$3N786: R301.2 U301.1
$3N1773: R306.2 U306.4 U307.4
$3N1782: C306.2 C307.2 R303.2 U307.7 U307.8
$3N1786: C304.2 C305.2 R302.2 U306.7 U306.8
$3N1823: R304.2 U306.2
$3N1859: R305.2 U307.2
$3N2345: L301.1 U306.9
$3N2349: L302.1 U306.10
$3N2354: L303.1 U307.9
$3N2359: L304.1 U307.10
$3N2408: L301.2 P301.1
$3N2410: L302.2 P301.2
$3N2458: L303.2 P302.1
$3N2460: L304.2 P302.2
$4N1101: Q203.1 Q204.3 R202.1
$4N1223: Q201.1 Q202.1 Q203.3 R201.1
$4N3126: Q204.1 R203.1
$4N3131: D201.2 D202.2 R202.2
$4N3143: D201.1 S201.1
$4N4759: C209.1 D205.1 U203.4
$4N4778: D205.2 L201.1 U203.3
$4N4869: D206.2 R204.1
$4N4910: D206.1 U203.8
$4N4944: R205.2 U203.7
$4N4990: R206.2 U203.6
$4N7774: P207.2 U204.7 U204.8
$4N7778: P207.1 U204.5 U204.6
$4N7783: P206.2 U205.7 U205.8
$4N7788: P206.1 U205.5 U205.6
$6N902: Q401.1 R401.2
$6N903: Q401.3 R402.1 R403.1
$6N904: Q402.1 R403.2
$6N905: Q402.3 R404.2
$6N906: Q403.1 R404.1 R405.2
$6N908: L401.1 Q403.2 R406.1 R407.2
$6N909: C401.1 D401.2 D402.1 R407.1
$6N910: C402.2 R408.2 R409.1 U401.1
$6N913: R410.1 R413.1 U401.4
$6N914: C402.1 D401.1 D402.2 D403.1 D404.1 L401.2 Q402.2 R402.2 R406.2 R408.1 U401.5
$6N916: C401.2 R410.2 U401.3
$6N919: R413.2 R414.1

Pads without a net: P201 1; P203 1; P204 1; U101 1 23 24; U104 9; U105 1 2 3 4 8 12 13 14; U107 7 8 13; U301 5 6 10; U303 5; U306 5 6 12 13; U307 5 6 12 13

## Via types
v1: diameter 0.5, hole 0.305, Top Layer to Bottom Layer, 327 vias

## Routing (per net, layer and track width the routed paths; a pad name or vN(x,y) marks a point on that pad's centre or on a via; arc(x,y) is an arc through that point)
+3V3: length 346.5
  Top Layer w0.2: U202.3 41.77,71.45 C207.2 C206.2 42.13,73.94 42.13,75.16 ; 28.58,90.44 28.58,90.53 26.93,92.18 C101.1 ; 28.58,90.44 28.78,90.23 33.59,90.23 34.68,89.14 v1(34.68,85.87) 33.5,85.87 32.82,85.19 C108.1 32.78,81.05 31.49,81.05 31.16,80.72 31.16,76.44 31.52,76.08 32.77,76.08 C102.2 33.74,75.22 U102.3 U103.3 42.06,75.22 42.13,75.16 ; 28.58,90.44 R101.2 ; 28.58,90.44 X001.4 ; 15.94,92.34 12.98,92.34 12.59,91.95 12.59,82.61 13.09,82.1 U104.4 ; 15.94,92.34 C109.2 ; 15.94,92.34 R004.1 R003.1 R008.1 R007.1 R006.1 R005.1 ; C114.1 33.89,6 v1(34.28,6.39) ; C107.1 42.13,75.16 ; 26.79,2.79 28.97,2.79 C001.2 29.81,3.39 29.81,5.29 R009.2 30.61,6.1 v1(30.61,6.82) ; v1(29.79,21.42) 24.14,21.42 24.12,21.44 23.73,21.44 23.71,21.42 8.15,21.42 R010.2 ; 65.9,86.25 U302.2
  Top Layer w0.254: 9.7,64.92 9.7,65.61 9.78,65.68 ; 9.7,64.92 9.3,64.52 C111.2 9.42,63.25 v1(10.13,63.25) ; 9.7,64.92 9.82,65.03 U107.9 ; 7.31,70.15 C110.1 ; 7.31,70.15 6.75,69.58 U107.1 ; 7.31,70.15 7.31,68.15 9.78,65.68 ; 36.62,34.87 36.62,36.81 36.44,36.99 34.49,36.99 34.25,36.75 U301.11 ; 36.62,34.87 36.62,33.11 35.93,32.42 C302.2 34.61,33.09 34.38,33.32 29.55,33.32 29.24,33.63 C301.1 ; 36.62,34.87 36.56,34.81 34.98,34.81 ; U202.3 41.77,69.07 40.64,67.94 40.64,66.46 39.32,65.14 v1(25.28,65.14) 14.83,65.14 v1(11.54,61.85) ; C303.2 65.9,86.25 ; 9.78,65.68 U107.10
  Top Layer w0.28: U301.3 32.51,35.31 32.5,35.3 32.08,35.3 32.07,35.31 29.5,35.31 C301.1
  Top Layer w0.3: v1(26.72,40.63) 28.6,40.63 29.56,39.67 48.81,39.67 52.54,43.4 64.29,43.4 65.23,44.34 U303.8 ; v1(26.84,33.69) 27.88,33.69 C301.1
  Top Layer w0.35: R001.1 R002.1 30.61,16.66 v1(30.59,16.68) ; R001.1 30.73,13.07 R117.2 ; R001.1 30.64,12.93 v1(30.64,12.16) ; C107.1 42.15,76.11 43.49,76.11 43.83,76.45 43.83,82.07 42.18,83.72 42.18,86.72 42.75,87.29 51.92,87.29 52.72,86.49 52.72,83.46 53.86,82.32 62.46,82.32 63.03,82.89 63.03,84.95 U302.2 ; v1(30.61,8.51) 30.61,8.51 v1(30.61,6.82) ; 32.22,33.32 32.22,33.32 v1(32.22,33.28)
  Bottom Layer w0.2: 29.76,21.39 29.74,21.39 ; U105.6 35.4,6.39 v1(34.28,6.39) 34.28,6.7 34.43,6.85 ; v1(34.68,85.87) 34.71,85.84 U101.11
  Bottom Layer w0.254: v1(10.13,63.25) 10.14,63.25 v1(11.54,61.85)
  Bottom Layer w0.3: v1(25.28,65.14) 24.98,64.84 24.98,42.37 v1(26.72,40.63) 26.72,36.45 27.06,36.11 27.06,36.04 27.06,36.04 27.06,35.61 27.06,35.61 27.06,35.32 26.84,35.1 v1(26.84,33.69)
  Bottom Layer w0.35: v1(30.61,8.51) 30.61,12.13 v1(30.64,12.16) ; U105.7 30.64,6.85 v1(30.61,6.82) ; v1(30.59,16.68) 29.74,17.53 29.74,21.39 29.83,21.48 29.83,26.81 29.84,26.82 29.84,27.27 29.83,27.28 29.83,29.58 32.22,31.97 v1(32.22,33.28)
+5V: length 146.7
  Top Layer w0.2: R303.1 15.58,37.11 v1(15.89,36.8) ; C205.2 43.18,62.89 ; 43.18,62.89 44.52,62.89 D404.2 44.77,62.37 42.78,60.38 37.94,60.38 v1(36.06,62.26) 34.86,63.46 C204.1 ; 43.18,62.89 43.27,62.97 U202.2 ; U201.2 27.85,56.82 v1(27.84,56.83) ; L102.1 50.15,24.32 51.86,22.61 D203.1 D204.1 55.69,19.03 C113.2 43.51,18.59 U106.6 ; R302.1 14.98,29.13 v1(14.69,29.42)
  Top Layer w0.35: L102.1 41.98,24.19 39.95,24.19 v1(39.5,23.74) ; v1(35.63,62.64) 35.65,62.66 35.66,62.66
  Bottom Layer w0.2: v1(27.24,56.83) 27.24,63.14 v1(27.54,63.44) ; v1(16.16,63.75) 15.89,63.48 v1(15.89,37.62) v1(15.89,36.8) 14.97,36.8 14.69,36.52 v1(14.69,29.42)
  Bottom Layer w0.35: v1(39.5,23.74) 35.66,27.58 35.66,37.56 34.69,38.53 34.69,50.25 35.63,51.19 v1(35.63,62.64)
  vias: v1(15.2,29.42) v1(15.48,63.75) v1(15.89,63.26) v1(28.11,63.42) v1(28.41,56.81) v1(28.51,63.42) v1(39.95,24.78)
+12V: length 86.6
  Top Layer w0.2: D403.2 49.36,63.92 Q202.2 ; 49.83,67.64 P001.5 60.08,71.41 C203.2 ; 49.83,67.64 Q202.2 ; 49.83,67.64 51.06,66.41 R020.1 ; v1(40.44,73.03) 34.9,73.03 34.48,72.61 34.48,71.48 C202.1 33.8,72.14 32.3,73.65 28.81,73.65 27.85,74.61 U201.1 ; v1(49.66,73.04) 49.65,73.03 49.36,73.03 ; 49.36,73.03 49.36,76.53 Q201.3 ; 49.36,73.03 Q202.2
  Top Layer w0.254: U204.4 41.21,34.29 C212.1 40.12,34.02 C214.2 ; 45.02,32.31 45.02,28.01 43.88,26.87 39.76,26.87 39.31,27.32 C213.2 40.12,28.79 C211.1
  Bottom Layer w0.2: v1(40.44,73.03) 40.45,73.04 v1(49.66,73.04)
  Bottom Layer w0.254: 44.59,72.04 44.25,72.38 44.16,72.38 ; 45.18,71.86 45.18,72.06 45.55,72.43
  vias: v1(40,73.45) v1(40,72.58) v1(44.6,32.64) v1(44.91,33.15) v1(45.17,32.66) v1(49.21,73.52) v1(49.26,72.5)
GND: length 796
  Top Layer w0.2: C103.2 36.22,81.12 C104.2 36.22,78.07 U102.1 35.57,76.66 34.35,76.66 33.47,77.53 C102.1 C108.2 ; v1(37.32,49.21) 38.13,49.21 38.38,49.46 Q401.2 ; C208.2 48.43,7.03 U203.9 ; C303.1 62.72,87.8 U302.3 U302.4 52.26,90.64 P202.1 ; U203.9 47.12,6.99 44.85,6.99 ; U203.9 48.55,5.56 C209.2 49.3,1.67 C210.2 ; v1(52.89,63.98) 52.89,63.06 R021.2 ; v1(7.15,1.53) 9.28,1.53 9.29,1.52 v1(19.49,1.52) 26.79,1.52 ; C109.1 14.78,90.91 14.27,90.39 U104.10 13.54,87.98 13.54,84.7 13.93,84.3 U104.6 ; R118.1 39.23,16.39 39.73,15.89 40.61,15.89 U106.2 v1(41.9,15.99) 42.03,16.12 42.03,18.67 C113.1 ; 1.21,1.25 1.21,20.27 P301.4 P301.3 P302.4 P302.3 ; 48.25,49.79 Q403.3 ; 48.25,49.79 48.25,49.78 48.25,43.8 47.78,43.33 R409.2 43.34,44.18 43.03,44.49 U401.2 38.55,44.49 v1(37.3,45.74) ; 48.25,49.79 R405.1 ; C106.2 40.81,79.37 R102.2 ; C106.2 39.9,79 39.9,77.69 40.06,77.53 C107.2 ; C106.2 39.62,79.47 C105.2 ; v1(25.05,87.22) 25.9,87.22 X001.2 ; v1(59.2,13.71) 59.2,10.85 61.27,8.78 U002.3 ; C101.2 29.26,92.34 v1(29.27,92.33)
  Top Layer w0.254: C110.2 9.31,73.49 9.85,74.02 U104.13 19.12,74.02 20.35,75.26 U201.3 20.35,85.82 21.75,87.22 v1(25.05,87.22) ; C214.1 37.91,35.18 C212.2 ; Q204.2 56.27,72.59 57.12,73.44 59.33,73.44 C203.1 61.48,73.5 S201.3 63.74,72.13 P001.6 ; 34.98,35.31 34.07,35.31 v1(34,35.38) 34,35.73 34.08,35.81 34.98,35.81 ; C213.1 37.91,29.86 C211.2 ; U104.11 4.38,88.68 1.31,88.68 1.13,88.5 1.13,73.61 1.39,73.35 U104.12 ; S201.4 61.89,78.17 Q203.2 ; v1(49.53,83.92) 49.53,85.15 C201.2 ; C108.2 33.43,79.69 33.78,80.04 33.78,84.37 34.24,84.83 35.2,84.83 35.59,85.22 v1(35.59,87.23)
  Top Layer w0.28: U307.17 13.32,33.07 U307.15 ; U307.17 13.32,33.57 U307.3 ; U307.17 12.82,33.07 U307.11 ; 13.5,23.27 13.5,24.52 U306.17 ; 11.75,24.52 13,24.52 U306.17 ; U306.17 13.5,25.02 U306.3
  Top Layer w0.3: P206.3 54.1,25.49 P207.3 P207.4
  Top Layer w0.35: C002.2 30.51,2.68 C001.1 ; C002.2 31.45,4.44 v1(32.12,3.78) ; C002.2 31.54,5.48 v1(31.54,5.77) 31.38,5.93 31.38,6 C114.2 ; C111.1 v1(7.9,65.62) 7.18,66.33 U107.6 ; 12.48,38.33 v1(13.11,38.33) 18.31,38.33 18.83,37.81 v1(18.83,34.44) R305.1 ; 12.48,38.33 v1(12.52,38.37) ; 12.48,38.33 C306.1 C307.1 ; C205.1 39.43,61.49 38.77,62.15 C204.2 ; U301.4 31.55,34.81 v1(31.46,34.72) ; 25.23,35.3 25.23,36.48 25.45,36.7 R301.1 ; 25.23,35.3 25.48,35.05 C301.2 ; 25.23,35.3 25.23,32.85 25.66,32.42 28.15,32.42 28.29,32.56 28.74,32.56 28.88,32.42 31.31,32.42 ; v1(38.91,69.71) 38.92,69.71 C202.2 ; v1(34.06,26.62) 34.33,26.35 R114.1 R113.1 R112.1 ; v1(32.06,10.53) 29.81,10.53 v1(29.7,10.64) ; 31.31,32.42 v1(31.46,32.57) ; 31.31,32.42 C302.1 ; P302.4 3.59,29.42 C304.1 C305.1 12.21,29.42 v1(12.49,29.7) ; U202.1 44.77,70.79 C207.1 C206.1 43.64,74.79 v1(43.92,75.07) ; v1(21.93,7.5) 21.59,7.84 U001.41 ; v1(38.55,22.03) 38.55,17.22 ; 38.55,17.22 v1(38.53,17.24) ; 38.55,17.22 38.55,16.96 38.58,16.93 R118.1 ; C112.1 v1(45,12.87) ; v1(24.93,9.63) 21.33,9.63 U001.41 ; v1(18.87,25.67) 18.87,24.58 R304.1 ; v1(20.76,57.55) 20.76,52.63 U201.4
  Bottom Layer w0.2: U101.2 39.21,86.88 38.64,87.45 ; v1(22.21,37.03) 22.21,48.52 20.92,49.81 20.92,57.84 20.76,58 ; 32.71,87.11 32.54,87.28 29.24,87.28 ; 32.71,87.11 U101.15 ; 32.71,87.11 33.05,87.45 38.64,87.45 ; v1(7.15,1.53) 2.74,1.53 v1(1.49,2.78) ; S201.3 S201.4 ; R104.2 R105.2 R106.2 R107.2 R108.2 R109.2 R110.2 R111.2 37.69,11.75 37.28,11.35 U105.16 ; v1(37.3,45.74) 37.32,45.76 v1(37.32,49.21) ; U101.26 41.24,87.45 38.64,87.45 ; 29.24,87.28 29.27,87.31 v1(29.27,92.33) ; 29.24,87.28 U101.25 26.45,87.22 v1(25.05,87.22)
  Bottom Layer w0.254: P202.1 49.53,90.34 v1(49.53,83.92) 42.26,83.92 41.41,84.76 U101.26 ; 42.88,83.24 41.2,81.56 v1(41.2,78.94)
  Bottom Layer w0.35: v1(12.49,29.7) 12.52,29.7 12.52,29.7 ; U302.3 61.81,88.79 63.77,86.83 63.77,80.05 S201.4 ; 39.28,69.34 v1(38.91,69.71) ; 39.28,69.34 39.28,70.48 38.26,71.5 38.26,73.85 39.21,74.8 43.65,74.8 v1(43.92,75.07) 44.39,75.54 44.39,83.36 44.05,83.7 43.59,83.24 42.88,83.24 ; 39.28,69.34 v1(39.28,61.64) ; 61.81,78.09 58.49,78.09 57.33,76.93 57.33,65.95 56.53,65.15 56.53,54.25 53.71,51.43 53.71,26.38 54.51,25.58 61.18,25.58 62,24.76 62,21.1 59.2,18.3 v1(59.2,13.71) ; 61.81,78.09 S201.4 ; 61.81,78.09 60.79,77.07 60.79,39.26 ; S201.4 55.15,79.13 53.69,77.67 53.69,69.42 52.89,68.62 v1(52.89,63.98) ; v1(55.08,39.06) 55.28,39.26 60.79,39.26 ; 12.52,29.7 v1(12.52,32.76) v1(12.52,33.9) v1(12.52,38.37) ; 12.52,29.7 12.52,25.5 v1(12.7,25.32) ; 31.62,5.85 U105.5 ; 31.62,5.85 v1(31.54,5.77) ; 31.62,5.85 30.14,5.85 29.56,6.43 23,6.43 v1(21.93,7.5) 19.49,5.06 v1(19.49,1.52) ; U105.41 32.56,3.34 v1(32.12,3.78) ; 23.26,90.72 20.76,88.22 20.76,58 ; v1(24.93,9.63) 28.7,9.63 v1(29.7,10.64) ; v1(18.87,25.67) 18.83,25.71 v1(18.83,34.44) ; P101.6 5.11,63.75 ; v1(41.9,15.99) 44.49,15.99 45.01,15.47 45.01,12.88 v1(45,12.87) 45,10.63 v1(47.26,8.37) ; P101.5 7.67,61.19 R413.3 ; U303.6 60.79,39.26 ; v1(31.46,32.57) v1(31.46,34.72) ; U105.16 34.56,11.35 33.74,10.53 v1(32.06,10.53) ; v1(38.55,22.03) 38.37,21.85 U105.37 33.07,21.85 32.56,22.36 U105.42 34,26.39 34,26.62 ; v1(38.53,17.24) 37.77,17.24 R108.2 ; 34,26.62 v1(34.06,26.62) ; 34,26.62 v1(34,35.38)
  vias: v1(0.81,71.45) v1(0.81,70.72) v1(1.3,71.09) v1(7.33,66.18) v1(8.9,72.54) v1(9.49,72.54) v1(10.1,72.54) v1(12.65,24.19) v1(13.85,90.15) v1(14.39,90.15) v1(19.11,36.24) v1(19.11,35.45) v1(19.36,25.54) v1(21.35,57.5) v1(21.93,57.5) v1(22.12,36.52) v1(22.36,36.06) v1(25.05,88.14) v1(25.5,87.64) v1(36.16,87.04) v1(37.61,28.76) v1(37.66,34.24) v1(38.1,28.91) v1(38.22,34.24) v1(39.51,69.89) v1(40.69,78.94) v1(40.94,78.45) v1(41.43,35.8) v1(41.44,35.21) v1(41.44,29.65) v1(41.46,29.06) v1(47.8,86.39) v1(48.21,48.42) v1(48.64,86.39) v1(48.75,48.41) v1(50.56,86.39) v1(51.39,86.39) v1(59.34,13.08) v1(59.7,13.45)
CAM_1V2: length 9.5
  Top Layer w0.2: v1(35.21,82.2) 36.46,82.2 37.38,81.28 C105.1 38.22,79.47 C106.1 38.13,77.81 U103.2
  Bottom Layer w0.2: U101.10 v1(35.21,82.2)
CAM_2V8: length 10.4
  Top Layer w0.2: v1(38.22,82.7) 34.99,82.7 34.66,82.37 34.66,81.28 34.7,81.24 U102.2
  Bottom Layer w0.2: U101.4 38.22,84.67 v1(38.22,82.7)
CAM_D0: length 125.2
  Top Layer w0.2: v1(25.34,10.42) 26.72,10.42 26.75,10.45 ; 17.52,90.83 17.52,88.14 v1(16.88,87.5) 15.88,86.5 U104.8 ; 26.75,10.45 28.02,10.45 28.87,11.3 33.28,11.3 33.75,11.76 v1(34.2,11.76) ; 26.75,10.45 26.79,10.41 ; v1(31.08,70.1) 26.06,70.1 v1(26.05,70.09) 16.35,70.09 v1(16.18,70.26)
  Bottom Layer w0.2: v1(16.18,70.26) 16.18,82.74 16.88,83.44 v1(16.88,87.5) ; U101.19 30.71,83.36 31.08,82.99 v1(31.08,70.1) ; U105.17 34.29,11.85 v1(34.2,11.76) ; v1(26.05,70.09) 24.63,68.67 24.63,41.97 26.36,40.24 26.36,36.36 26.07,36.07 26.07,30.96 26.07,30.96 26.07,11.65 25.34,10.92 v1(25.34,10.42)
CAM_D1: length 117.1
  Top Layer w0.2: v1(33.88,12.36) 33.88,12.32 33.23,11.68 17.64,11.68 v1(17.61,11.65) ; v1(14.02,78.77) 15.08,78.77 U104.1 16.93,78.8 17.57,79.45 17.57,85.32 21.14,88.89 22.89,88.89 v1(23.56,89.56) 24.83,90.83
  Bottom Layer w0.2: v1(17.61,11.65) 17.21,12.05 17.21,47.17 17.66,47.62 17.66,48.33 17.12,48.87 17.12,48.96 17.11,48.97 17.11,64.02 15.33,65.8 15.33,69.16 13.87,70.62 13.87,78.62 v1(14.02,78.77) ; U105.18 33.89,12.35 v1(33.88,12.36) ; v1(23.56,89.56) 23.56,86.47 24.06,85.97 29.47,85.97 29.71,85.72 U101.21
CAM_D2: length 114.9
  Top Layer w0.2: v1(22.59,13.62) 12.51,13.62 10.57,11.68 9.29,11.68 ; v1(27.15,30.53) 27.13,30.55 v1(22.65,30.55)
  Bottom Layer w0.2: v1(27.15,30.53) 27.15,30.43 27.45,30.12 ; 27.45,30.12 27.45,30.28 29.48,32.31 29.48,83.21 29.21,83.48 U101.22 ; 27.45,30.12 27.6,29.97 27.6,26.76 27.61,26.75 27.61,26.36 27.34,26.09 27.33,26.09 27.28,26.04 27.28,16.95 31.38,12.85 U105.19 ; v1(22.59,13.62) 22.59,30.49 v1(22.65,30.55)
CAM_D3: length 108.3
  Top Layer w0.2: v1(24.82,24.74) 24.86,24.7 27.72,24.7 v1(27.75,24.73) ; v1(23.06,13.05) 12.61,13.05 9.97,10.41 9.29,10.41
  Bottom Layer w0.2: v1(23.06,13.05) 23.06,15.9 24.39,17.23 24.39,22.59 24.23,22.75 24.23,24.14 v1(24.82,24.74) ; U105.20 31.3,13.35 27.75,16.9 v1(27.75,24.73) 27.91,24.89 27.91,26.23 27.92,26.24 27.92,26.88 27.91,26.89 27.91,30.31 29.78,32.19 29.78,83.16 30.21,83.59 U101.20
CAM_D4: length 105.7
  Top Layer w0.2: H002.3 12.03,52.06 18.96,58.99 v1(31.12,58.99)
  Bottom Layer w0.2: U101.18 31.21,83.29 31.38,83.12 31.38,70.46 31.55,70.29 31.55,69.9 31.12,69.47 v1(31.12,58.99) 31.12,47.33 31.55,46.9 31.55,37.91 30.08,36.44 30.08,32.06 28.21,30.19 28.21,27.01 28.22,27 28.22,26.11 28.21,26.1 28.21,24.93 28.22,24.92 28.22,24.53 28.07,24.38 28.07,17.01 31.23,13.85 U105.21
CAM_D5: length 103.9
  Top Layer w0.2: v1(32.23,47.3) 16.44,47.3 14.22,49.52 H003.3
  Bottom Layer w0.2: U101.16 32.21,47.31 32.22,47.31 v1(32.23,47.3) 31.85,46.92 31.85,37.78 30.39,36.31 30.39,31.94 28.51,30.06 28.51,27.14 28.52,27.13 28.52,25.99 28.51,25.98 28.51,25.06 28.52,25.05 28.52,24.41 28.37,24.26 28.37,17.13 31.16,14.35 U105.22
CAM_D6: length 108.6
  Top Layer w0.2: v1(24.7,22.99) 28.8,22.99 v1(28.84,23.03) ; 9.29,9.14 10.03,9.14 13.45,12.56 v1(23.59,12.56)
  Bottom Layer w0.2: U101.14 33.21,83.43 32.82,83.04 32.82,37.37 32.6,37.15 31.66,37.15 30.69,36.18 30.69,31.81 28.81,29.94 28.81,27.26 28.82,27.25 28.82,25.86 28.81,25.85 28.81,25.18 28.82,25.17 28.82,24.28 28.81,24.27 28.81,23.06 28.9,22.97 28.77,22.97 28.68,22.88 28.68,17.25 31.09,14.85 U105.23 ; v1(24.7,22.99) 24.7,17.12 24.66,17.08 24.66,17.07 23.51,15.92 23.51,14.56 23.59,14.48 v1(23.59,12.56)
CAM_D7: length 109.7
  Top Layer w0.2: 9.29,14.22 21.59,14.22 v1(21.6,14.23) ; v1(21.92,27.11) 29.22,27.11 v1(29.29,27.04)
  Bottom Layer w0.2: v1(21.92,27.11) 21.9,27.09 21.9,20.19 21.6,19.89 v1(21.6,14.23) ; U105.24 31.01,15.35 29.32,17.04 29.32,27.01 v1(29.29,27.04) 29.29,29.99 30.99,31.69 30.99,35.91 31.83,36.75 32.62,36.75 33.12,37.25 33.12,82.71 34.21,83.8 U101.12
CAM_HREF: length 93.2
  Top Layer w0.2: 9.29,15.49 7.73,15.49 v1(7.7,15.52) ; v1(9.22,61.02) 9.27,61.07 9.63,61.07 15.7,67.14 v1(33.6,67.14)
  Bottom Layer w0.2: v1(9.22,61.02) 9.22,46.67 9.12,46.58 9.12,23.67 8.33,22.87 8.33,19.56 7.7,18.93 v1(7.7,15.52) ; U101.9 35.77,84.62 35.77,76.72 33.52,74.47 33.52,67.22 v1(33.6,67.14)
CAM_PCLK: length 73.6
  Top Layer w0.2: U001.15 25.03,19.87 v1(23.92,20.97) ; v1(31.71,69.11) 31.67,69.15 v1(24.3,69.15)
  Bottom Layer w0.2: v1(23.92,20.97) 23.92,25.9 24.3,26.27 v1(24.3,69.15) ; v1(31.71,69.11) 31.85,69.25 31.85,70.42 31.71,70.56 31.71,84.68 U101.17
CAM_PWDN: length 98.6
  Top Layer w0.2: v1(14.86,68.62) 14.88,68.64 v1(34.03,68.64) ; U001.23 14.87,18.25 v1(14.78,18.16) ; v1(36.19,76.48) 36.21,76.46 38.09,76.46 38.87,77.24 38.87,81.77 39.13,82.03 40.45,82.03 R102.1
  Bottom Layer w0.2: v1(34.03,68.64) 34.03,74.32 36.21,76.5 U101.8 ; v1(14.86,68.62) 14.83,68.59 14.83,46.71 14.18,46.06 14.18,18.76 v1(14.78,18.16)
CAM_RESET: length 233.3
  Top Layer w0.2: v1(9.74,61.84) 9.86,61.72 15.76,67.63 v1(37.28,67.63) ; v1(32.21,8.49) 32.22,8.48 R115.1 32.97,6.87 36.41,6.87 v1(36.44,6.9) ; v1(23.83,26.47) 23.84,26.48 ; 23.84,26.48 18.24,26.48 R306.1 ; 23.84,26.48 23.92,26.56 v1(27.14,26.56) ; v1(62.14,19.09) 63.26,20.21 63.26,41.51 v1(63.07,41.7) ; v1(60.18,16.59) 60.15,16.62 Q001.3 58.59,16.62 58.59,16.62 57.69,17.52 v1(48.21,17.52) ; R116.1 43.1,79.39 43.1,76.97 42.96,76.83 40.66,76.83 40.25,76.42 v1(38.96,76.42) ; v1(23.48,17.69) 23.48,17.52 21.85,15.89 12.38,15.89 10.31,17.96 9.36,17.96 9.29,18.03 v1(8.17,18.03) 4.94,18.03 4.91,18 ; C003.1 4.46,19.23 4.47,19.24 4.91,18.79 4.91,18 ; 4.91,18 SW02.2
  Bottom Layer w0.2: v1(8.17,18.03) 8.17,18.97 8.63,19.43 8.63,22.75 9.43,23.54 9.43,46.45 9.69,46.72 9.69,61.79 v1(9.74,61.84) ; U303.7 63.17,41.8 v1(63.07,41.7) ; v1(23.48,17.69) 23.83,18.03 23.83,20.32 23.7,20.45 23.7,20.53 23.41,20.82 23.41,21.12 23.58,21.29 23.58,25.98 23.79,26.19 23.79,26.43 v1(23.83,26.47) ; v1(36.44,6.9) 37.94,5.4 47.25,5.4 47.85,6 47.85,15.8 48.28,16.23 48.28,17.45 v1(48.21,17.52) ; v1(27.14,26.56) 26.98,26.39 26.98,16.75 31.2,12.53 31.2,8.78 31.49,8.49 v1(32.21,8.49) ; v1(62.14,19.09) 62.14,18.55 v1(60.18,16.59) ; v1(38.96,76.42) 38.96,75.82 36.5,73.36 36.5,70.93 37.09,70.34 37.09,67.82 v1(37.28,67.63)
CAM_SCL: length 83.7
  Top Layer w0.2: R002.2 28.87,14.24 v1(28.39,14.24) 26.81,14.24 26.79,14.22 ; v1(27.43,37.85) 30.49,37.85 31.05,37.29 33.73,37.29 33.75,37.27 U301.12
  Bottom Layer w0.2: U101.5 37.71,81.9 37.06,81.25 37.06,76.19 34.87,74 34.87,70.04 35.08,69.82 35.08,69.3 34.66,68.88 34.66,67.29 33.48,66.11 33.48,37.54 v1(33.68,37.34) ; v1(27.43,37.85) 27.48,37.8 27.48,33.63 26.68,32.82 26.68,30.71 26.67,30.71 26.67,16.49 28.39,14.78 v1(28.39,14.24)
CAM_SDA: length 90.3
  Top Layer w0.2: U301.2 v1(32.29,35.81) 32.27,35.83 v1(26.54,35.83) ; v1(32.28,34.03) 32.54,33.77 34.65,33.77 v1(34.67,33.75) ; R001.2 29.1,12.95 v1(28.15,12.95) 26.79,12.95
  Bottom Layer w0.2: v1(28.15,12.95) 28.15,13.81 26.37,15.59 26.37,30.84 26.37,30.84 26.37,35.66 v1(26.54,35.83) ; U101.3 38.71,82.33 37.41,81.03 37.41,81.01 37.41,81 37.41,76.04 35.21,73.84 35.21,70.16 35.39,69.98 35.39,69.15 35.06,68.82 35.06,67.14 33.8,65.88 33.8,59.07 33.79,59.06 33.79,58.67 33.8,58.66 33.8,37.96 34.67,37.09 v1(34.67,33.75) ; v1(32.28,34.03) 32.29,34.04 v1(32.29,35.81)
CAM_VSYNC: length 101
  Top Layer w0.2: v1(34.54,69.62) 15.62,69.62 14.92,70.32 v1(11.3,70.32) ; v1(7.23,12.86) 9.2,12.86 9.29,12.95
  Bottom Layer w0.2: v1(11.3,70.32) 11.12,70.32 11,70.2 11,65.08 8.75,62.83 8.75,60.82 8.92,60.66 8.92,46.8 8.82,46.7 8.82,23.79 8.03,23 8.03,19.75 7.24,18.96 7.24,16.86 7.23,16.85 v1(7.23,12.86) ; v1(34.54,69.62) 34.54,74.16 36.71,76.33 U101.7
CAM_XCLK: length 6.8
  Top Layer w0.2: X001.3 33.67,86.3 v1(33.71,86.34)
  Bottom Layer w0.2: U101.13 v1(33.71,86.34)
CH343_3V3: length 9.6
  Top Layer w0.2: U002.2 63.81,9.39 63.16,10.04 ; 63.16,10.04 63.1,9.98 v1(63.1,9.45) ; 63.16,10.04 R013.1
  Bottom Layer w0.2: U002.8 61.27,9.25 61.47,9.45 v1(63.1,9.45)
ESP32_RXD: length 118.7
  Top Layer w0.2: U002.5 56.19,7.28 55.01,8.46 ; v1(33.87,4.5) 36.35,4.5 36.71,4.14 v1(36.71,1.38) ; 55.01,8.46 54.22,9.25 54.22,11.89 52.3,13.81 52.27,13.77 v1(52.26,13.77) ; 55.01,8.46 v1(54.46,8.46) ; 9.29,6.6 12.53,6.6 14.03,5.1 14.03,5.1 14.2,4.93 v1(23.94,4.93) ; v1(54.72,61.04) 54.91,61.23 54.91,61.24 55.19,61.52 55.2,61.52 57.32,63.64 P001.3
  Bottom Layer w0.2: v1(36.71,1.38) 36.78,1.38 37.22,1.82 51.93,1.82 54.09,3.97 54.09,8.09 54.45,8.46 v1(54.46,8.46) ; v1(33.87,4.5) 33.61,4.76 29.23,4.76 29.06,4.93 v1(23.94,4.93) ; v1(52.26,13.77) 52.3,13.81 52.3,52.44 54.72,54.86 v1(54.72,61.04)
ESP32_TXD: length 118.7
  Top Layer w0.2: P001.2 55.97,61.64 v1(55.38,61.05) ; U002.4 58.73,8.61 58.06,9.28 55.69,9.28 v1(55.13,9.84) 54.61,10.36 54.61,12.31 52.77,14.15 v1(52.77,14.25) ; v1(36.12,1.97) 36.12,3.56 35.7,3.98 v1(33.43,3.98) ; 9.29,5.33 13.37,5.33 13.9,4.79 13.91,4.79 14.24,4.46 v1(23.4,4.46)
  Bottom Layer w0.2: v1(55.38,61.05) 55.38,54.8 52.67,52.09 52.67,14.35 v1(52.77,14.25) ; v1(23.4,4.46) 32.96,4.46 v1(33.43,3.98) ; v1(55.13,9.84) 53.78,8.49 53.78,4.1 51.83,2.15 36.58,2.15 36.4,1.97 v1(36.12,1.97)
GPIO1: length 153.7
  Top Layer w0.2: v1(28.71,1.28) 28.84,1.15 34.94,1.15 v1(35.09,1) ; v1(12.79,66.98) 12.78,66.98 U107.12 ; v1(24.45,2.96) 11.94,2.96 v1(11.86,2.88) 11.77,2.79 9.29,2.79
  Bottom Layer w0.2: U303.4 63.46,34.18 62.71,33.43 62.71,13.59 60.73,11.6 55.56,11.6 53.18,9.22 53.18,4.35 51.62,2.79 35.65,2.79 35.09,2.23 v1(35.09,1) ; v1(12.79,66.98) 12.96,66.81 12.96,47.85 10.94,45.83 10.94,4.4 11.11,4.23 11.11,3.63 v1(11.86,2.88) ; v1(24.45,2.96) 27.62,2.96 28.71,1.87 v1(28.71,1.28)
GPIO2: length 150.7
  Top Layer w0.2: 9.29,4.06 9.35,4 11.77,4 ; 11.77,4 13.61,4 14.18,3.43 v1(25.05,3.43) ; 11.77,4 v1(11.73,4.04) ; v1(29.43,1.62) 35.55,1.62 v1(35.63,1.54) ; U107.14 12.84,68.28 v1(12.87,68.25)
  Bottom Layer w0.2: v1(25.05,3.43) 27.62,3.43 v1(29.43,1.62) ; U303.3 65.8,31.71 64.02,31.71 63.19,30.88 63.19,13.64 60.85,11.3 55.69,11.3 53.48,9.09 53.48,4.22 51.74,2.48 35.83,2.48 35.63,2.28 v1(35.63,1.54) ; v1(11.73,4.04) 11.58,4.19 11.57,4.19 11.24,4.52 11.24,45.7 13.26,47.72 13.26,67.86 v1(12.87,68.25)
GPIO4: length 71.3
  Top Layer w0.2: 26.79,5.33 24.2,5.33 24.13,5.4 14.15,5.4 10.77,8.78 v1(10.47,8.78) ; H001.2 5.43,53.27 v1(10.52,53.27)
  Bottom Layer w0.2: v1(10.52,53.27) 10.33,53.08 10.33,49.08 11.1,48.31 11.1,46.85 10.33,46.08 10.33,18.82 9.32,17.81 9.32,9.07 9.61,8.78 v1(10.47,8.78)
GPIO5: length 65.8
  Top Layer w0.2: 26.79,6.6 17.45,6.6 v1(17.2,6.85) ; H002.2 5.48,50.68 14.48,50.68 v1(17.16,48)
  Bottom Layer w0.2: v1(17.2,6.85) 16.91,7.14 16.91,47.75 v1(17.16,48)
GPIO6: length 9.6
  Top Layer w0.2: v1(34.04,8.85) 34.04,9.05 33.7,9.39 29.83,9.39 28.31,7.87 26.79,7.87
  Bottom Layer w0.2: U105.11 35.44,8.85 v1(34.04,8.85)
GPIO7: length 97.2
  Top Layer w0.2: v1(19.09,58.45) 19.13,58.49 31.37,58.49 31.75,58.87 42.85,58.87 44.2,60.22 51.73,60.22 51.74,60.21 v1(54.05,60.21) ; v1(54.04,64.93) 54.04,65.79 D202.1 ; v1(23.07,8.62) 24.66,8.62 25.18,9.14 26.79,9.14
  Bottom Layer w0.2: v1(54.05,60.21) 54.05,64.92 v1(54.04,64.93) ; v1(19.09,58.45) 18.83,58.19 18.83,49.65 19.54,48.93 19.54,46.39 20.17,45.77 20.17,44.97 21.4,43.74 21.4,20.21 21.09,19.9 21.09,13.76 23.07,11.78 v1(23.07,8.62)
GPIO8: length 21.2
  Top Layer w0.2: 26.79,15.49 25.7,15.49 v1(25.13,16.07)
  Bottom Layer w0.2: U105.10 34.13,8.35 33.8,8.02 24.72,8.02 24.45,8.29 24.45,15.2 25.13,15.88 v1(25.13,16.07)
GPIO9: length 24.9
  Top Layer w0.2: U001.17 22.49,17.95 v1(22.12,17.58) ; v1(23.98,14.76) 22.15,14.76 v1(22.12,14.79)
  Bottom Layer w0.2: U105.9 34.06,7.85 33.9,7.69 24.37,7.69 24.06,8 24.06,14.68 v1(23.98,14.76) ; v1(22.12,14.79) v1(22.12,17.58)
GPIO10: length 43
  Top Layer w0.2: U001.18 21.22,20.33 v1(20.93,20.62) ; v1(19.62,45.39) 19.62,45.44 19.62,45.44 12.16,45.44 11.85,45.75 5.34,45.75 H004.2
  Bottom Layer w0.2: v1(19.62,45.39) 19.62,44.86 20.93,43.55 v1(20.93,20.62)
GPIO11: length 40.3
  Top Layer w0.2: v1(19.95,20.73) 19.95,20.73 U001.19 ; H005.2 5.33,43.22 10.2,43.22 10.21,43.21 v1(19.94,43.21)
  Bottom Layer w0.2: v1(19.94,43.21) 19.95,43.2 v1(19.95,20.73)
GPIO12: length 37
  Top Layer w0.2: U001.20 18.55,19.44 v1(18.55,20.58) ; v1(18.34,40.96) 18.08,41.22 17.87,41.22 17.86,41.23 8.49,41.23 8.08,40.82 8.06,40.82 7.9,40.67 5.34,40.67 H006.2
  Bottom Layer w0.2: v1(18.55,20.58) 18.15,20.97 18.15,40.77 v1(18.34,40.96)
GPIO13: length 37.9
  Top Layer w0.2: v1(17.68,40.72) 8.62,40.72 v1(8.25,40.35) ; v1(17.68,20.66) 17.41,20.38 U001.21 ; v1(8.06,38.52) 7.59,38.05 5.42,38.05 H007.2
  Bottom Layer w0.2: v1(17.68,40.72) 17.51,40.56 17.51,20.83 v1(17.68,20.66) ; v1(8.06,38.52) 8.25,38.71 v1(8.25,40.35)
GPIO14: length 124.9
  Top Layer w0.2: v1(13.7,39.82) 17.2,39.82 17.44,39.58 27.39,39.58 27.7,39.27 29.31,39.27 29.36,39.32 48.96,39.32 52.61,42.97 63.26,42.97 64.02,42.21 64.02,30.95 U303.2 ; U001.22 16.14,17.81 15.94,17.61 13.98,17.61 v1(13.88,17.71) ; v1(13.89,69.49) 13.79,69.58 U107.16
  Bottom Layer w0.2: v1(13.88,17.71) 13.86,17.73 13.86,39.66 v1(13.7,39.82) 13.88,40 13.88,68.14 14.03,68.29 14.03,69.35 v1(13.89,69.49)
GPIO19: length 80
  Top Layer w0.2: v1(25.13,16.89) 25.26,16.76 26.79,16.76 ; v1(25.77,38.95) 25.79,38.97 49.04,38.97 52.64,42.58 62.98,42.58 63.61,41.95 63.61,28.82 U303.1
  Bottom Layer w0.2: v1(25.77,38.95) 25.77,31.09 25.29,30.61 25.29,17.06 v1(25.13,16.89)
GPIO20: length 72.9
  Top Layer w0.2: 26.79,18.03 26.7,17.94 24.4,17.94 21.83,15.37 v1(11.79,15.37) ; v1(13.56,68.89) 11.25,68.89 U107.15
  Bottom Layer w0.2: v1(11.79,15.37) 11.79,16.73 11.54,16.98 11.54,45.58 13.56,47.6 v1(13.56,68.89)
GPIO35: length 53
  Top Layer w0.2: 9.29,16.76 10.45,16.76 v1(10.47,16.74) ; v1(12.49,66.33) 12.48,66.33 U107.11
  Bottom Layer w0.2: v1(10.47,16.74) 10.63,16.91 10.63,45.95 12.65,47.97 12.65,66.16 v1(12.49,66.33)
GPIO42: length 50.2
  Top Layer w0.2: v1(10.47,8.02) 10.32,7.87 9.29,7.87 ; H003.2 5.48,48.14 v1(10.58,48.14)
  Bottom Layer w0.2: v1(10.47,8.02) 9.58,8.02 9.02,8.58 9.02,17.94 10.03,18.95 10.03,46.2 10.39,46.56 10.39,47.94 v1(10.58,48.14)
GPIO45: length 123.3
  Top Layer w0.2: U306.14 13,22.69 ; 13,22.69 13.43,22.26 v1(20.46,22.26) ; 13,22.69 12.88,22.57 v1(9.56,22.57) ; v1(9.54,19.56) 9.83,19.28 U001.26 ; U307.1 14.57,31.47 14.71,31.33 v1(20.46,31.33) ; v1(36.23,66.2) 36.23,66.23 36.21,66.26 19.32,66.26 v1(19.2,66.14) ; U302.5 52.39,87.97 42.06,87.97 40.51,86.42 v1(40.51,83.59)
  Bottom Layer w0.2: v1(19.2,66.14) 18.5,65.44 18.5,49.38 19.09,48.79 19.09,48.71 19.24,48.55 19.24,46.28 19.09,46.13 19.09,44.96 20.57,43.48 20.57,31.27 ; v1(9.54,19.56) 9.57,19.59 9.57,22.55 v1(9.56,22.57) ; v1(36.23,66.2) 36.43,66.39 36.43,69.98 35.85,70.56 35.85,73.61 38.03,75.79 38.03,80.57 40.55,83.09 40.55,83.55 v1(40.51,83.59) ; 20.57,31.27 20.57,22.37 v1(20.46,22.26) ; 20.57,31.27 20.51,31.33 v1(20.46,31.33)
GPIO46: length 121.4
  Top Layer w0.2: v1(23.11,22.73) 23.1,22.74 14.2,22.74 14,22.94 U306.16 ; v1(23.23,20.34) 23.76,19.81 U001.16 ; v1(41.01,82.87) 41.01,86.24 42.44,87.66 52.21,87.66 53.1,86.78 53.1,85.71 54.11,84.7 U302.6 ; v1(36.76,65.78) 36.71,65.73 23.72,65.73 v1(23.67,65.78) ; v1(23.67,29.96) 13.17,29.96 12.82,30.31 U307.14
  Bottom Layer w0.2: v1(41.01,82.87) 38.42,80.28 38.42,75.75 36.18,73.51 36.18,70.79 36.76,70.21 v1(36.76,65.78) ; v1(23.23,20.34) 23.11,20.45 v1(23.11,22.73) 23.11,29.4 v1(23.67,29.96) v1(23.67,65.78)
GPIO47: length 23.8
  Top Layer w0.2: v1(16.16,17.11) 16.15,17.11 13.74,17.11 13.41,17.44 13.41,19.12 U001.24 ; v1(16.23,23.29) 16.01,23.29 15.28,24.02 U306.1 ; v1(16.34,30.78) 14.08,30.78 13.82,31.04 U307.16
  Bottom Layer w0.2: v1(16.34,30.78) 16.37,30.75 16.37,23.43 v1(16.23,23.29) 16.12,23.18 16.12,17.15 v1(16.16,17.11)
GPIO48: length 119.9
  Top Layer w0.2: v1(35.95,68.13) 15.67,68.13 10.09,62.54 v1(10.01,62.54) ; U302.1 58.29,83.71 54.59,87.41 53.48,87.41 52.62,88.27 41.65,88.27 39.93,86.55 v1(39.93,83.15) ; v1(9.1,20.92) 11.98,20.92 12.33,20.57 U001.25
  Bottom Layer w0.2: v1(9.1,20.92) 9.09,20.93 9.09,22.78 9.73,23.42 9.73,46.33 9.99,46.59 9.99,61.43 10.21,61.65 10.21,62.04 10.01,62.23 v1(10.01,62.54) ; v1(35.95,68.13) 35.95,69.97 35.54,70.38 35.54,73.73 37.71,75.9 37.71,80.88 39.93,83.1 v1(39.93,83.15)
METAL_ADC: length 12.3
  Top Layer w0.2: H001.1 1.67,54.72 1.67,56.98 1.87,57.18 10.8,57.18 R414.2
METAL_DEC: length 45.1
  Top Layer w0.2: v1(35.03,52.13) 35.03,51.43 34.89,51.29 ; v1(34.92,59.67) 34.8,59.79 18.91,59.79 13.06,53.94 v1(8.09,53.94)
  Bottom Layer w0.2: v1(35.03,52.13) 34.92,52.24 v1(34.92,59.67) ; v1(8.09,53.94) 7.42,53.27 2.77,53.27 H002.1
MOT1_A: length 44.3
  Top Layer w0.2: H004.3 7.33,46.3 11.86,46.3 12.1,46.06 31.07,46.06 v1(31.08,46.07) ; U204.1 41.1,38.1 40.76,38.45 v1(31.06,38.45)
  Bottom Layer w0.2: v1(31.08,46.07) 31.06,46.05 v1(31.06,38.45)
MOT1_B: length 43.2
  Top Layer w0.2: v1(32.35,37.92) 32.55,38.12 40.55,38.12 41.71,36.96 42.59,36.96 U204.2 ; H005.3 32.34,44.45 v1(32.35,44.44)
  Bottom Layer w0.2: v1(32.35,44.44) v1(32.35,37.92)
MOT2_A: length 46.4
  Top Layer w0.2: v1(28.51,32.01) 28.81,31.72 35.76,31.72 35.95,31.91 U205.1 ; v1(28.51,41.9) 28.25,42.16 17.87,42.16 17.7,41.99 8.16,41.99 8.08,41.91 6.65,41.91 H006.3
  Bottom Layer w0.2: v1(28.51,41.9) v1(28.51,32.01)
MOT2_B: length 45.7
  Top Layer w0.2: v1(27.95,31.45) 28.07,31.33 35.88,31.33 36.11,31.56 40.75,31.56 41.71,30.6 41.87,30.6 41.92,30.64 U205.2 ; v1(28.01,39.76) 27.73,40.04 17.4,40.04 17.12,40.32 9.23,40.32 8.28,39.37 H007.3
  Bottom Layer w0.2: v1(27.95,31.45) 28.01,31.51 v1(28.01,39.76)
PRINTER_DTR: length 66.2
  Top Layer w0.2: v1(8.45,52.55) 12.09,52.55 19.03,59.49 31.47,59.49 31.76,59.2 42.76,59.2 44.17,60.61 53.42,60.61 58.45,65.64 60.08,65.64
  Bottom Layer w0.2: v1(8.45,52.55) 8.45,51.3 8.05,50.91 6.86,50.91 6.7,50.75 2.79,50.75 H003.1
SD_CLK/SCK: length 66.9
  Top Layer w0.2: 20.43,90.83 20.43,89.51 16.5,85.58 16.5,83.73 v1(16.1,83.33) 15.98,83.2 U104.5 ; v1(18.35,46.75) 16.57,46.75 14.39,48.93 v1(7.9,48.93)
  Bottom Layer w0.2: v1(18.35,46.75) 18.35,48.59 17.74,49.2 17.74,64.45 16.06,66.13 16.06,69.45 15.41,70.1 15.41,82.64 v1(16.1,83.33) ; v1(7.9,48.93) 7.27,48.3 2.87,48.3 H004.1
SD_CMD/MOSI: length 63.4
  Top Layer w0.2: v1(8.45,47.13) 8.59,46.99 14.35,46.99 v1(14.36,46.98) ; 21.92,90.83 20.81,89.72 20.81,89.46 16.93,85.58 16.93,81.31 16.63,81 U104.3 15.07,80.96 v1(13.56,80.96)
  Bottom Layer w0.2: v1(13.56,80.96) 13.55,80.95 13.55,70.51 14.36,69.7 v1(14.36,46.98) ; v1(8.45,47.13) 7.03,45.71 2.82,45.71 H005.1
SD_D0/MISO: length 68.5
  Top Layer w0.2: v1(17.73,43.8) 8.04,43.8 v1(8.02,43.82) ; 16.17,85.96 16.17,86.13 18.97,88.93 18.97,90.83 ; 16.17,85.96 15.62,85.4 U104.7 ; 16.17,85.96 v1(16.28,86.07)
  Bottom Layer w0.2: H006.1 2.76,43.11 7.31,43.11 v1(8.02,43.82) ; v1(16.28,86.07) 16.25,86.07 15.11,84.93 15.11,69.97 15.67,69.41 15.67,66.02 17.42,64.27 17.42,48.99 17.96,48.45 17.96,47.3 17.73,47.07 v1(17.73,43.8)
SD_D3/CS: length 72.8
  Top Layer w0.2: 22.13,89.56 21.38,89.56 17.27,85.45 17.27,80.47 v1(16.74,79.94) ; v1(8.04,41.44) 8.28,41.69 v1(18.06,41.69) ; 22.12,89.57 23.38,90.83 ; U104.2 16.77,79.9
  Bottom Layer w0.2: v1(8.04,41.44) 7.13,40.54 2.73,40.54 H007.1 ; v1(18.06,41.69) 18.22,41.85 18.22,45.69 18.94,46.41 18.94,48.43 18.13,49.24 18.13,64.68 16.7,66.11 16.7,79.9 v1(16.74,79.94)
